# EAGLE schematic Aqua_D_CTRL (EAGLE 9.6.2)

## Sheet 1 of 6
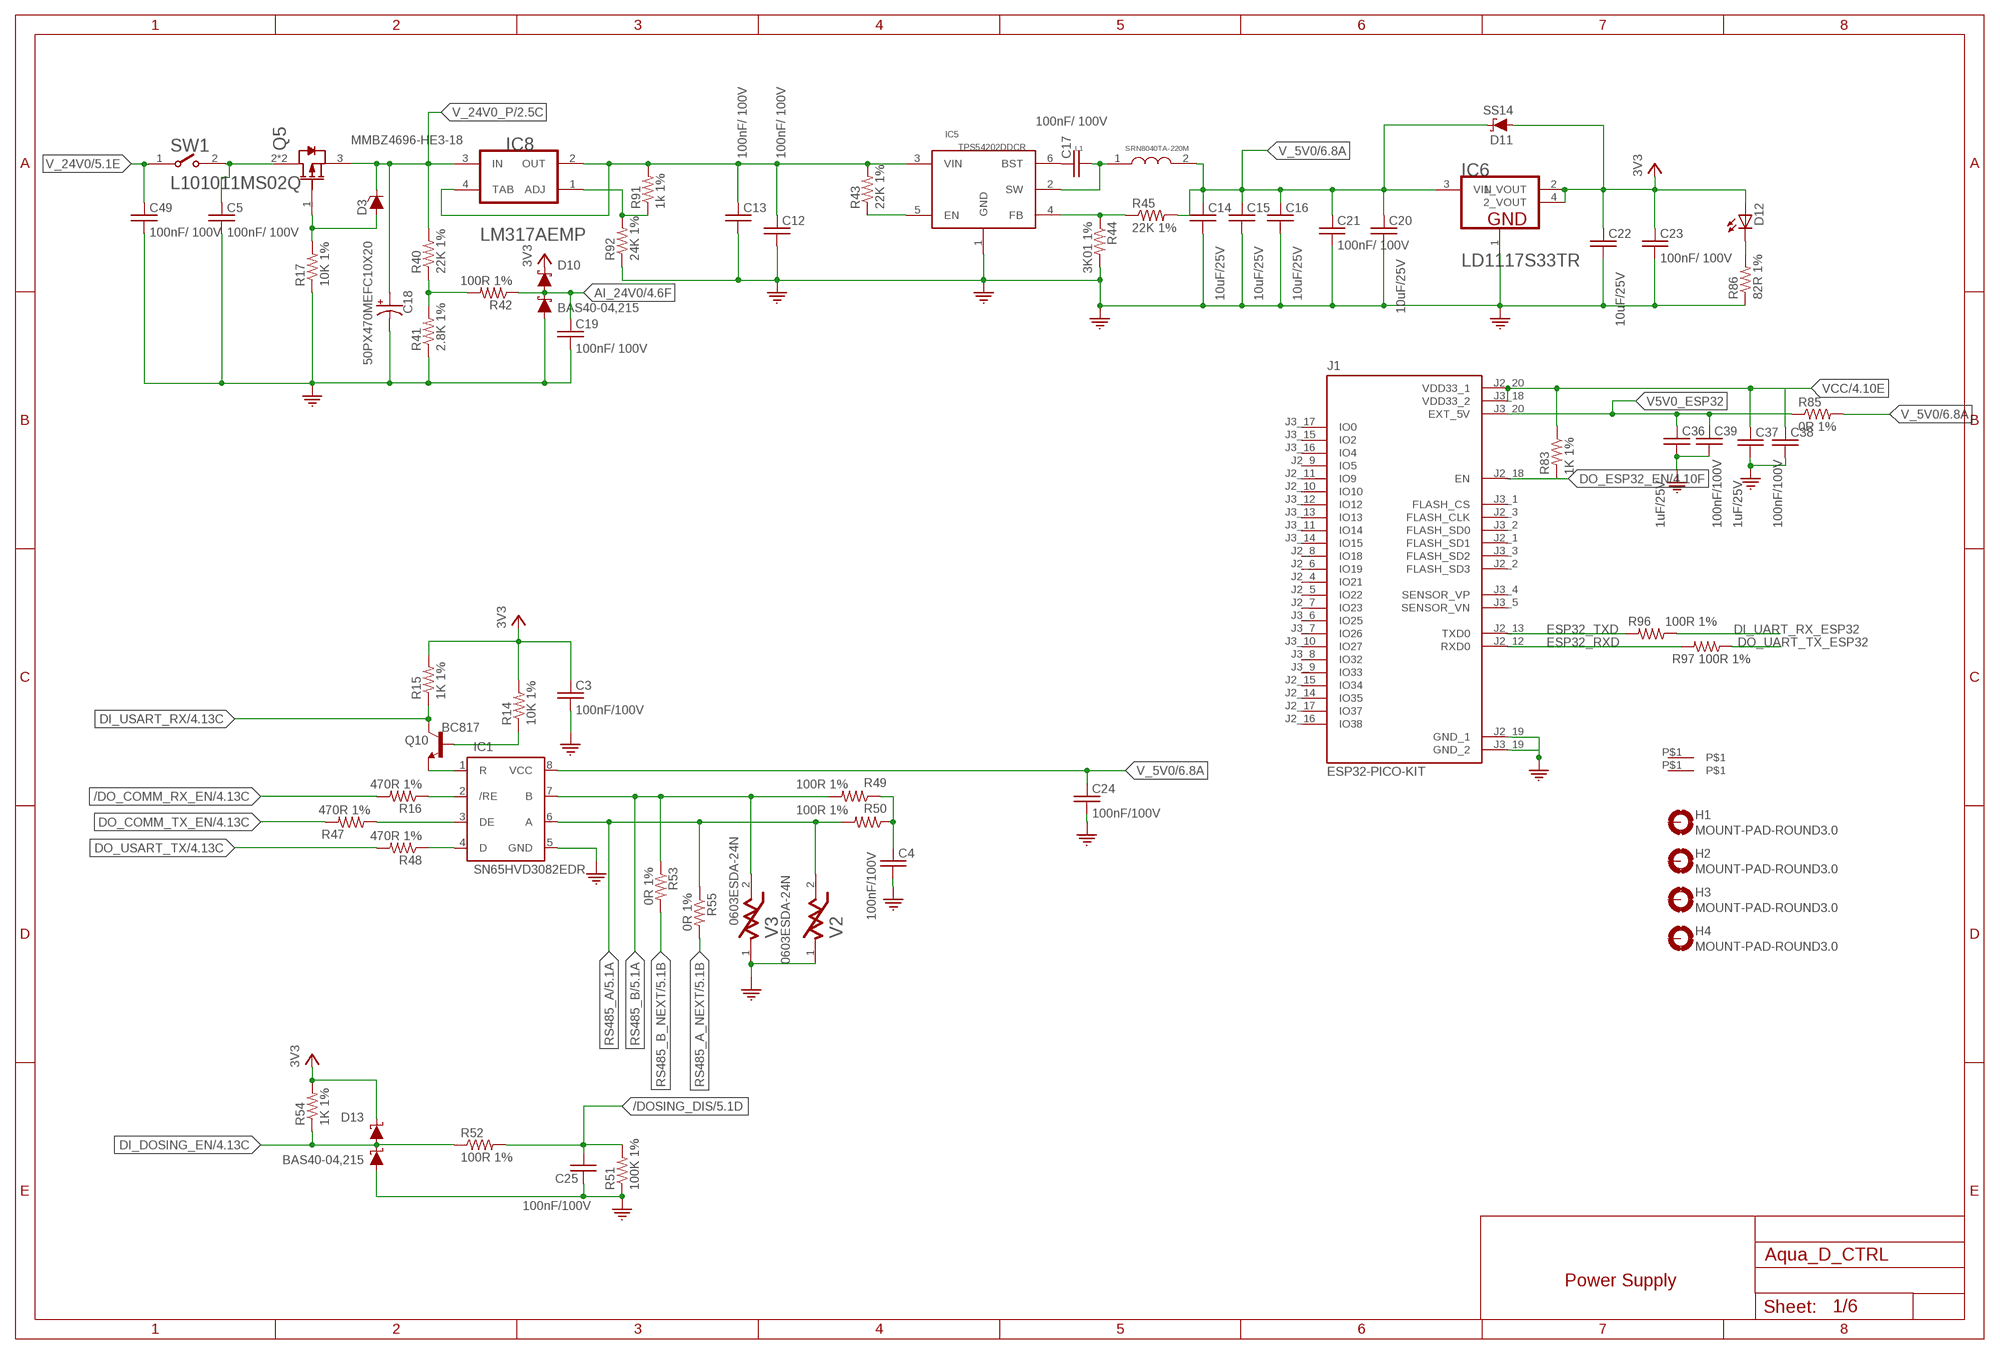
[diagram p0: schematic, sheet 1]

### Parts
C3  100nF/100V  C_0603  [0603]
C4  100nF/100V  C_0603  [0603]
C5  100nF/ 100V  C_0603  [0603]
C12  100nF/ 100V  C_0603  [0603]
C13  100nF/ 100V  C_0603  [0603]
C14  10uF/25V  C_0603  [0603]
C15  10uF/25V  C_0603  [0603]
C16  10uF/25V  C_0603  [0603]
C17  100nF/ 100V  C_0603  [0603]
C18  50PX470MEFC10X20  [CAPACITOR-ELKO-RM5-10X16]
C19  100nF/ 100V  C_0603  [0603]
C20  10uF/25V  C_0603  [0603]
C21  100nF/ 100V  C_0603  [0603]
C22  10uF/25V  C_0603  [0603]
C23  100nF/ 100V  C_0603  [0603]
C24  100nF/100V  C_0603  [0603]
C25  100nF/100V  C_0603  [0603]
C36  1uF/25V  C_0603  [0603]
C37  1uF/25V  C_0603  [0603]
C38  100nF/100V  C_0603  [0603]
C39  100nF/100V  C_0603  [0603]
C49  100nF/ 100V  C_0603  [0603]
D3  MMBZ4696-HE3-18  [SOT23-3]
D10  BAS40-04,215  [SOT23-3]
D11  SS14  [SMA]
D12  26-21/GPC-F3138B/CA  [SMD1206-LED]
D13  BAS40-04,215  [SOT23-3]
FID1  FIDUCIAL  [FIDUCIAL]
FID2  FIDUCIAL  [FIDUCIAL]
H1  MOUNT-PAD-ROUND3.0  [3,0-PAD]
H2  MOUNT-PAD-ROUND3.0  [3,0-PAD]
H3  MOUNT-PAD-ROUND3.0  [3,0-PAD]
H4  MOUNT-PAD-ROUND3.0  [3,0-PAD]
IC1  SN65HVD3082EDR  [SOIC8]
IC5  TPS54202DDCR  [SOT23-6]
IC6  LD1117S33TR  [SOT223_LD1117S33TR]
IC8  LM317AEMP  [SOT223_LM317AEMP]
J1  ESP32-PICO-KIT  [XCVR_ESP32-PICO-KIT]
L1  SRN8040TA-220M  [SRN8040TA-220M]
Q5  DMP6185SEQ-13  [SOT223]
Q10  BC817  [SOT23]
R14  10K 1%  R_0603  [R0603]
R15  1K 1%  R_0603  [R0603]
R16  470R 1%  R_0603  [R0603]
R17  10K 1%  R_0603  [R0603]
R40  22K 1%  R_0603  [R0603]
R41  2.8K 1%  R_0603  [R0603]
R42  100R 1%  R_0603  [R0603]
R43  22K 1%  R_0603  [R0603]
R44  3K01 1%  R_0603  [R0603]
R45  22K 1%  R_0603  [R0603]
R47  470R 1%  R_0603  [R0603]
R48  470R 1%  R_0603  [R0603]
R49  100R 1%  R_0603  [R0603]
R50  100R 1%  R_0603  [R0603]
R51  100K 1%  R_1206  [R1206]
R52  100R 1%  R_0603  [R0603]
R53  0R 1%  R_0603  [R0603]
R54  1K 1%  R_1206  [R1206]
R55  0R 1%  R_0603  [R0603]
R83  1K 1%  R_0603  [R0603]
R85  0R 1%  R_1206  [R1206]
R86  82R 1%  R_1206  [R1206]
R91  1k 1%  R_0603  [R0603]
R92  24K 1%  R_0603  [R0603]
R96  100R 1%  R_0603  [R0603]
R97  100R 1%  R_0603  [R0603]
SW1  L101011MS02Q  [L101011MS02Q]
V2  0603ESDA-24N  [0603]
V3  0603ESDA-24N  [0603]

### Nets
/DO_COMM_RX_EN [LV]: R16.2 ; also sheet 4
/DOSING_DIS [LV]: C25.2 R51.2 R52.2 ; also sheet 5
AI_24V0 [LV]: C19.1 D10.3(C1_A2) R42.1 ; also sheet 4
DI_DOSING_EN [LV]: D13.3(C1_A2) R52.1 R54.1 ; also sheet 4
DI_UART_RX_ESP32 [LV]: R96.1 ; also sheet 4
DI_USART_RX [LV]: Q10.3(C) R15.1 ; also sheet 4
DO_COMM_TX_EN [LV]: R47.2 ; also sheet 4
DO_ESP32_EN [LV]: J1.J2_18(EN) R83.2 ; also sheet 4
DO_UART_TX_ESP32 [LV]: R97.1 ; also sheet 4
DO_USART_TX [LV]: R48.2 ; also sheet 4
ESP32_RXD [LV]: J1.J2_12(RXD0) R97.2
ESP32_TXD [LV]: J1.J2_13(TXD0) R96.2
GND [LV]: C3.2 C4.2 C5.2 C12.2 C13.2 C14.2 C15.2 C16.2 C18.2(-) C19.2 C20.2 C21.2 C22.2 C23.2 C24.2 C25.1 C36.2 C37.2 C38.2 C39.2 C49.2 D10.1(A1) D13.1(A1) IC1.5(GND) IC5.1(GND) IC6.1(GND) J1.J2_19(GND_1) J1.J3_19(GND_2) R17.1 R41.1 R44.2 R51.1 R86.1 R92.1 V2.1 V3.1 ; also sheet 2,3,4,5,6
N$2 [LV]: C5.1 Q5.2(DRAIN) Q5.4(DRAIN) SW1.2
N$9 [LV]: Q10.1(B) R14.1
N$10 [LV]: C12.1 C13.1 IC5.3(VIN) IC8.2(OUT) IC8.4(TAB) R43.2 R91.2
N$16 [LV]: D3.1(A) Q5.1(GATE) R17.2
N$20 [LV]: IC8.1(ADJ) R91.1 R92.2
N$27 [LV]: R40.1 R41.2 R42.2
N$29 [LV]: IC1.1(R) Q10.2(E)
N$30 [LV]: C17.2 IC5.2(SW) L1.1
N$31 [LV]: IC1.2(/RE) R16.1
N$32 [LV]: IC5.5(EN) R43.1
N$33 [LV]: IC5.4(FB) R44.1 R45.1
N$34: C17.1 IC5.6(BST)
N$37 [LV]: IC1.3(DE) R47.1
N$38 [LV]: IC1.4(D) R48.1
N$42 [LV]: C4.1 R49.1 R50.1
N$83 [LV]: D12.2(C) R86.2
RS485_A [LV]: IC1.6(A) R50.2 R55.1 V2.2 ; also sheet 5
RS485_A_NEXT [LV]: R55.2 ; also sheet 5
RS485_B [LV]: IC1.7(B) R49.2 R53.1 V3.2 ; also sheet 5
RS485_B_NEXT [LV]: R53.2 ; also sheet 5
V5V0_ESP32: C36.1 C39.1 J1.J3_20(EXT_5V) R85.1
V_5V0 [LV]: C14.1 C15.1 C16.1 C20.1 C21.1 C24.1 D11.1(C) IC1.8(VCC) IC6.3(VIN) L1.2 R45.2 R85.2 ; also sheet 6
V_24V0 [LV]: C49.1 SW1.1 ; also sheet 5
V_24V0_P [LV]: C18.1(+) D3.3(C) IC8.3(IN) Q5.3(SOURCE) R40.2 ; also sheet 2,3
VCC [LV]: C3.1 C22.1 C23.1 C37.1 C38.1 D10.2(C2) D11.2(A) D12.1(A) D13.2(C2) IC6.2(1_VOUT) IC6.4(2_VOUT) J1.J2_20(VDD33_1) J1.J3_18(VDD33_2) R14.2 R15.2 R54.2 R83.1 ; supply symbol labelled 3V3 ; also sheet 2,3,4
Unconnected: FID1.P$1 FID2.P$1 H1.B3,0(MOUNT) H2.B3,0(MOUNT) H3.B3,0(MOUNT) H4.B3,0(MOUNT) J1.J2_1(FLASH_SD1) J1.J2_2(FLASH_SD3) J1.J2_3(FLASH_CLK) J1.J2_4(IO21) J1.J2_5(IO22) J1.J2_6(IO19) J1.J2_7(IO23) J1.J2_8(IO18) J1.J2_9(IO5) J1.J2_10(IO10) J1.J2_11(IO9) J1.J2_14(IO35) J1.J2_15(IO34) J1.J2_16(IO38) J1.J2_17(IO37) J1.J3_1(FLASH_CS) J1.J3_2(FLASH_SD0) J1.J3_3(FLASH_SD2) J1.J3_4(SENSOR_VP) J1.J3_5(SENSOR_VN) J1.J3_6(IO25) J1.J3_7(IO26) J1.J3_8(IO32) J1.J3_9(IO33) J1.J3_10(IO27) J1.J3_11(IO14) J1.J3_12(IO12) J1.J3_13(IO13) J1.J3_14(IO15) J1.J3_15(IO2) J1.J3_16(IO4) J1.J3_17(IO0)

### Notes on the sheet
- Power Supply

## Sheet 2 of 6
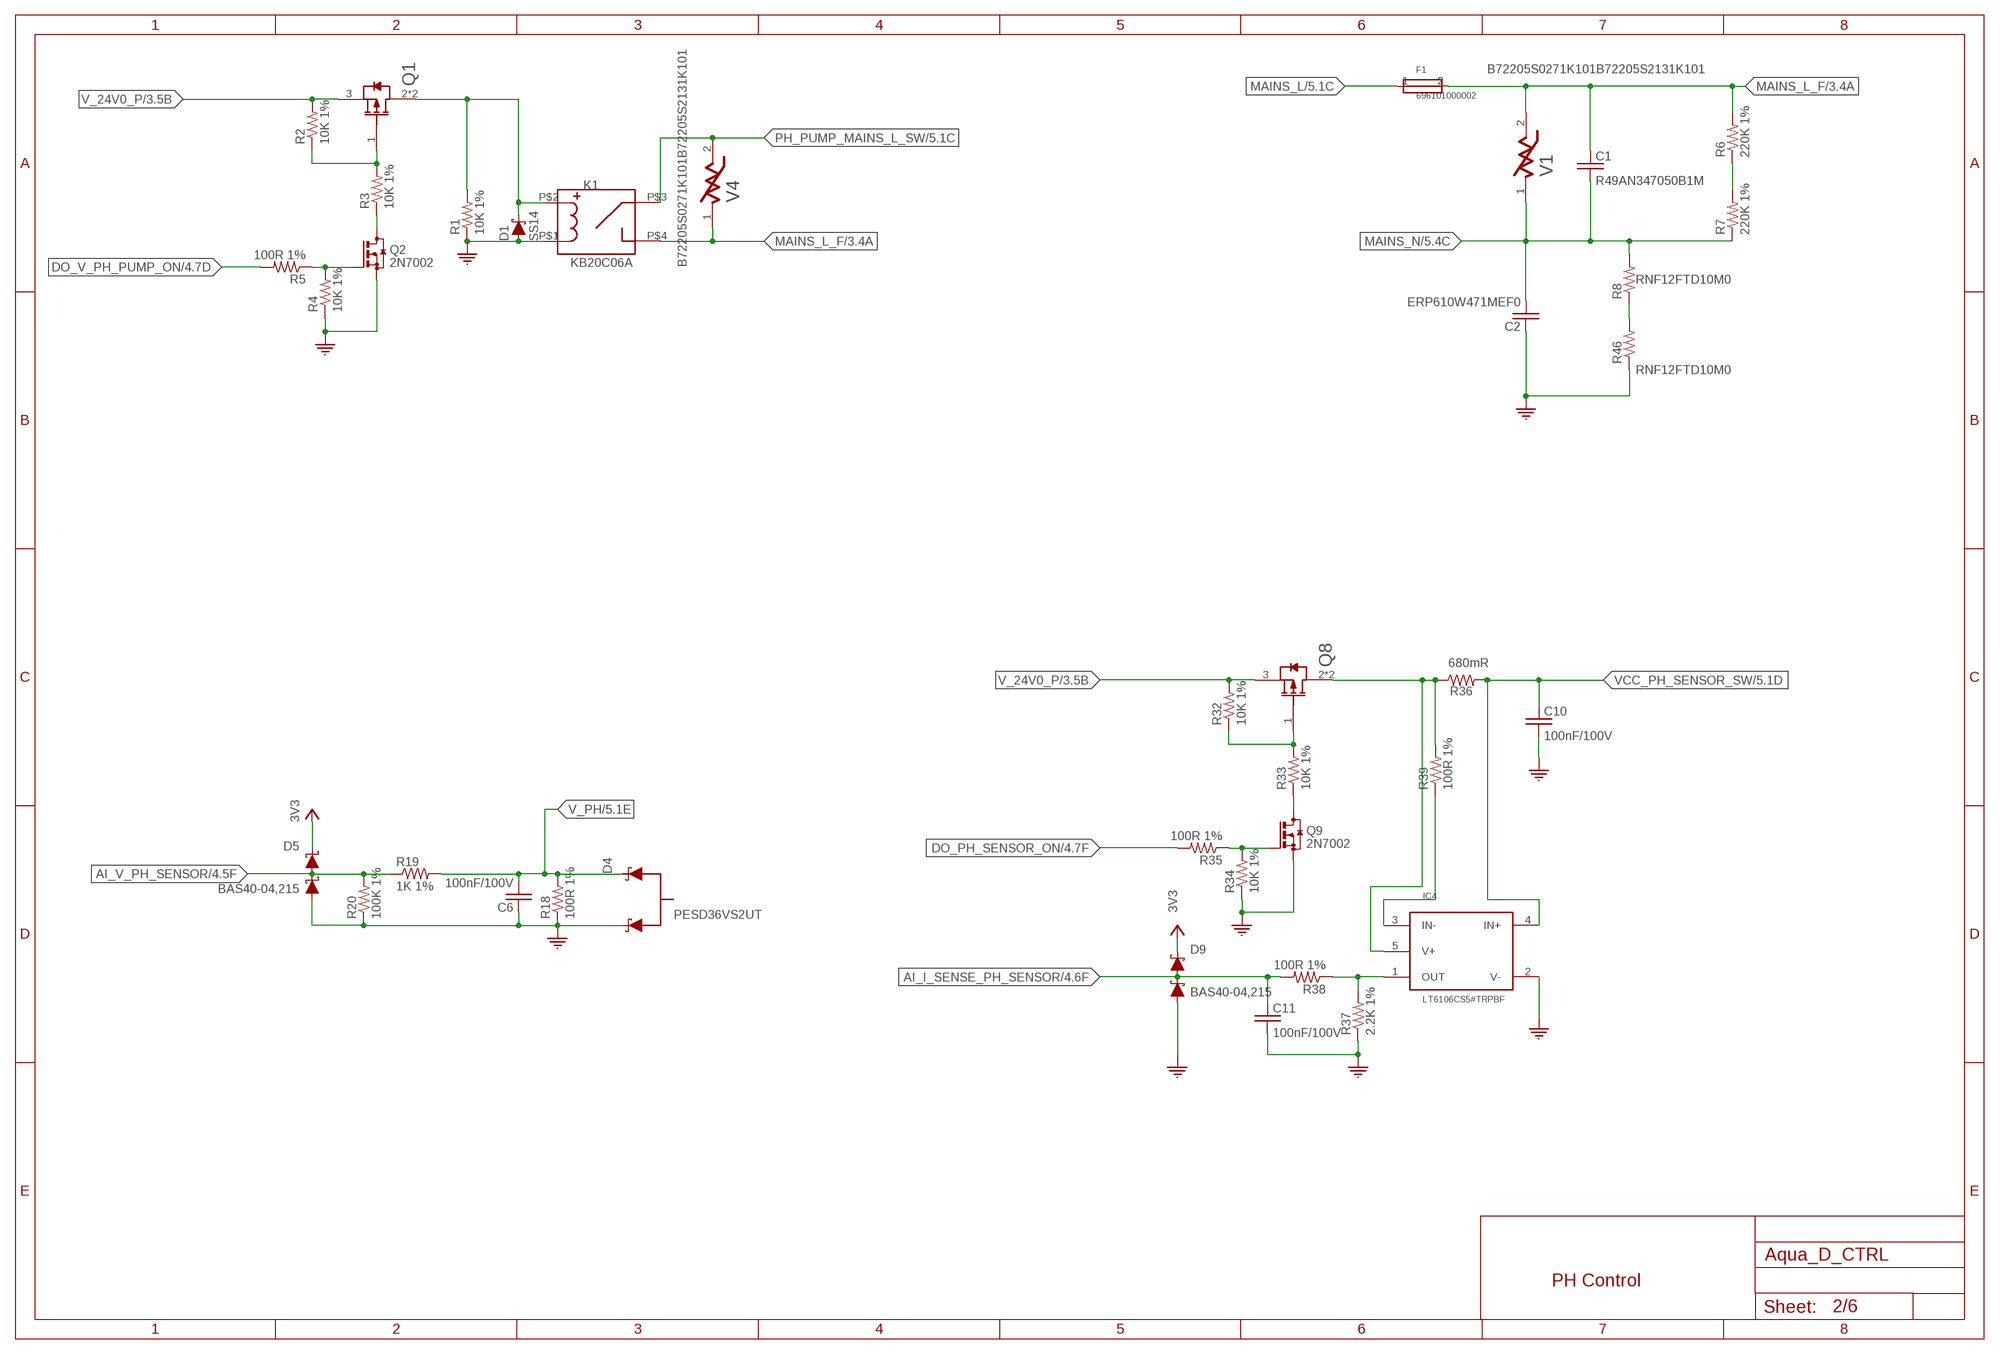
[diagram p1: schematic, sheet 2]

### Parts
C1  R49AN347050B1M  [R49AN347050B1M]
C2  ERP610W471MEF0  [CAP-P12.5-H15-W4-D1]
C6  100nF/100V  C_0603  [0603]
C10  100nF/100V  C_0603  [0603]
C11  100nF/100V  C_0603  [0603]
D1  SS14  [SMA]
D4  PESD36VS2UT  [SOT23-3]
D5  BAS40-04,215  [SOT23-3]
D9  BAS40-04,215  [SOT23-3]
F1  696101000002  [FUSE_RM22.6]
IC4  LT6106CS5#TRPBF  [SOT-23-5]
K1  KB20C06A  [RELAY_KYOTO_KF0604D]
Q1  DMP6185SEQ-13  [SOT223]
Q2  2N7002  [SOT23]
Q8  DMP6185SEQ-13  [SOT223]
Q9  2N7002  [SOT23]
R1  10K 1%  R_0603  [0603]
R2  10K 1%  R_0603  [0603]
R3  10K 1%  R_0603  [0603]
R4  10K 1%  R_0603  [0603]
R5  100R 1%  R_0603  [0603]
R6  220K 1%  R_2010  [R2010]
R7  220K 1%  R_2010  [R2010]
R8  RNF12FTD10M0  [RES-RM12.5-VR37]
R18  100R 1%  R_1206  [R1206]
R19  1K 1%  R_0603  [R0603]
R20  100K 1%  R_0603  [R0603]
R32  10K 1%  R_0603  [0603]
R33  10K 1%  R_0603  [0603]
R34  10K 1%  R_0603  [0603]
R35  100R 1%  R_0603  [0603]
R36  R_2010  [R2010]
R37  2.2K 1%  R_0603  [0603]
R38  100R 1%  R_0603  [0603]
R39  100R 1%  R_0603  [0603]
R46  RNF12FTD10M0  [RES-RM12.5-VR37]
V1  B72205S0271K101B72205S2131K101  [EPCOS_B72205S0271K101_0]
V4  B72205S0271K101B72205S2131K101  [EPCOS_B72205S0271K101_0]

### Nets
AI_I_SENSE_PH_SENSOR [LV]: C11.1 D9.3(C1_A2) R38.2 ; also sheet 4
AI_V_PH_SENSOR [LV]: D5.3(C1_A2) R19.1 R20.2 ; also sheet 4
DO_PH_SENSOR_ON [LV]: R35.2 ; also sheet 4
DO_V_PH_PUMP_ON [LV]: R5.2 ; also sheet 4
GND [LV]: C2.P$1 C6.1 C10.2 C11.2 D1.2(A) D4.1(C1) D5.1(A1) D9.1(A1) IC4.2(V-) K1.P$1 Q2.2(S) Q9.2(S) R1.1 R4.1 R18.1 R20.1 R34.1 R37.1 R46.1 ; also sheet 1,3,4,5,6
MAINS_L [Mains_L]: F1.1 ; also sheet 5
MAINS_L_F [Mains_L]: C1.1 F1.2 K1.P$4 R6.2 V1.2 V4.1 ; also sheet 3
MAINS_N [Mains_N]: C1.2 C2.P$2 R7.1 R8.2 V1.1 ; also sheet 5
N$1 [LV]: D1.1(C) K1.P$2 Q1.2(DRAIN) Q1.4(DRAIN) R1.2
N$3 [LV]: Q1.1(GATE) R2.1 R3.2
N$4 [Mains_N]: R6.1 R7.2
N$6 [LV]: Q2.3(D) R3.1
N$8 [LV]: Q2.1(G) R4.2 R5.1
N$21 [LV]: Q8.1(GATE) R32.1 R33.2
N$22 [LV]: Q9.3(D) R33.1
N$23 [LV]: Q9.1(G) R34.2 R35.1
N$24 [LV]: IC4.3(IN-) R39.1
N$25 [LV]: IC4.1(OUT) R37.2 R38.1
N$26 [LV]: IC4.5(V+) Q8.2(DRAIN) Q8.4(DRAIN) R36.1 R39.2
N$28: R8.1 R46.2
PH_PUMP_MAINS_L_SW [Mains_L]: K1.P$3 V4.2 ; also sheet 5
V_24V0_P [LV]: Q1.3(SOURCE) Q8.3(SOURCE) R2.2 R32.2 ; also sheet 1,3
V_PH [LV]: C6.2 D4.2(C2) R18.2 R19.2 ; also sheet 5
VCC [LV]: D5.2(C2) D9.2(C2) ; supply symbol labelled 3V3 ; also sheet 1,3,4
VCC_PH_SENSOR_SW [LV]: C10.1 IC4.4(IN+) R36.2 ; also sheet 5
Unconnected: D4.3(A)

### Notes on the sheet
- PH Control

## Sheet 3 of 6
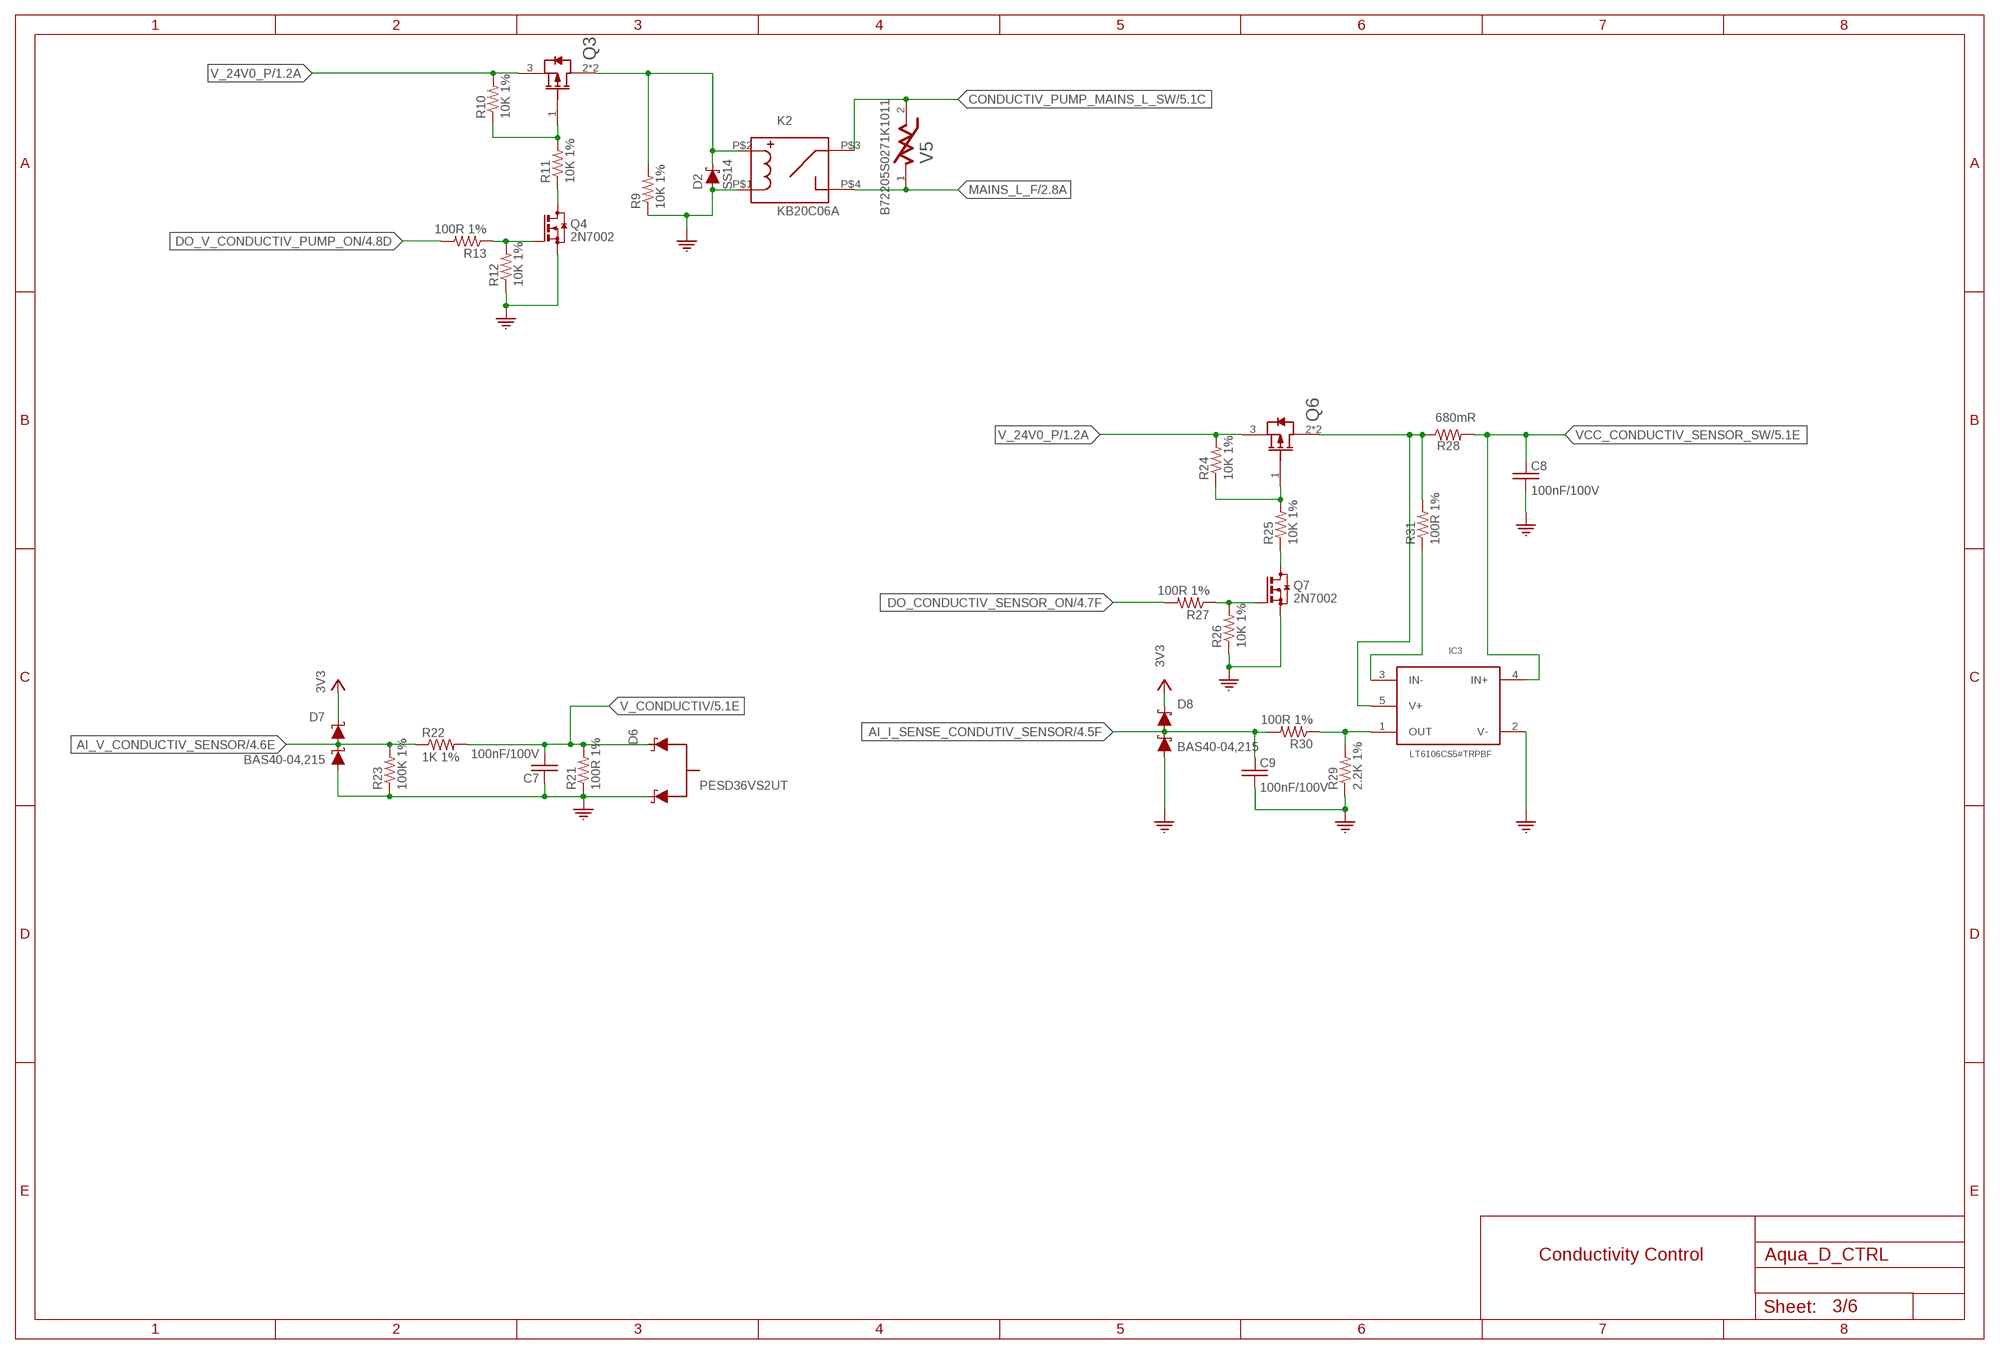
[diagram p2: schematic, sheet 3]

### Parts
C7  100nF/100V  C_0603  [0603]
C8  100nF/100V  C_0603  [0603]
C9  100nF/100V  C_0603  [0603]
D2  SS14  [SMA]
D6  PESD36VS2UT  [SOT23-3]
D7  BAS40-04,215  [SOT23-3]
D8  BAS40-04,215  [SOT23-3]
IC3  LT6106CS5#TRPBF  [SOT-23-5]
K2  KB20C06A  [RELAY_KYOTO_KF0604D]
Q3  DMP6185SEQ-13  [SOT223]
Q4  2N7002  [SOT23]
Q6  DMP6185SEQ-13  [SOT223]
Q7  2N7002  [SOT23]
R9  10K 1%  R_0603  [0603]
R10  10K 1%  R_0603  [0603]
R11  10K 1%  R_0603  [0603]
R12  10K 1%  R_0603  [0603]
R13  100R 1%  R_0603  [0603]
R21  100R 1%  R_1206  [R1206]
R22  1K 1%  R_0603  [R0603]
R23  100K 1%  R_0603  [R0603]
R24  10K 1%  R_0603  [0603]
R25  10K 1%  R_0603  [0603]
R26  10K 1%  R_0603  [0603]
R27  100R 1%  R_0603  [0603]
R28  R_2010  [R2010]
R29  2.2K 1%  R_0603  [0603]
R30  100R 1%  R_0603  [0603]
R31  100R 1%  R_0603  [0603]
V5  B72205S0271K1011  [EPCOS_B72205S0271K101_MODIFIED]

### Nets
AI_I_SENSE_CONDUTIV_SENSOR [LV]: C9.1 D8.3(C1_A2) R30.2 ; also sheet 4
AI_V_CONDUCTIV_SENSOR [LV]: D7.3(C1_A2) R22.1 R23.2 ; also sheet 4
CONDUCTIV_PUMP_MAINS_L_SW [Mains_L]: K2.P$3 V5.2 ; also sheet 5
DO_CONDUCTIV_SENSOR_ON [LV]: R27.2 ; also sheet 4
DO_V_CONDUCTIV_PUMP_ON [LV]: R13.2 ; also sheet 4
GND [LV]: C7.1 C8.2 C9.2 D2.2(A) D6.1(C1) D7.1(A1) D8.1(A1) IC3.2(V-) K2.P$1 Q4.2(S) Q7.2(S) R9.1 R12.1 R21.1 R23.1 R26.1 R29.1 ; also sheet 1,2,4,5,6
MAINS_L_F [Mains_L]: K2.P$4 V5.1 ; also sheet 2
N$5: D2.1(C) K2.P$2 Q3.2(DRAIN) Q3.4(DRAIN) R9.2
N$7 [LV]: IC3.3(IN-) R31.1
N$11 [LV]: Q3.1(GATE) R10.1 R11.2
N$12 [LV]: Q4.3(D) R11.1
N$13 [LV]: Q6.1(GATE) R24.1 R25.2
N$14 [LV]: Q4.1(G) R12.2 R13.1
N$15 [LV]: Q7.3(D) R25.1
N$17 [LV]: Q7.1(G) R26.2 R27.1
N$18 [LV]: IC3.1(OUT) R29.2 R30.1
N$19 [LV]: IC3.5(V+) Q6.2(DRAIN) Q6.4(DRAIN) R28.1 R31.2
V_24V0_P [LV]: Q3.3(SOURCE) Q6.3(SOURCE) R10.2 R24.2 ; also sheet 1,2
V_CONDUCTIV [LV]: C7.2 D6.2(C2) R21.2 R22.2 ; also sheet 5
VCC [LV]: D7.2(C2) D8.2(C2) ; supply symbol labelled 3V3 ; also sheet 1,2,4
VCC_CONDUCTIV_SENSOR_SW [LV]: C8.1 IC3.4(IN+) R28.2 ; also sheet 5
Unconnected: D6.3(A)

### Notes on the sheet
- Conductivity Control

## Sheet 4 of 6
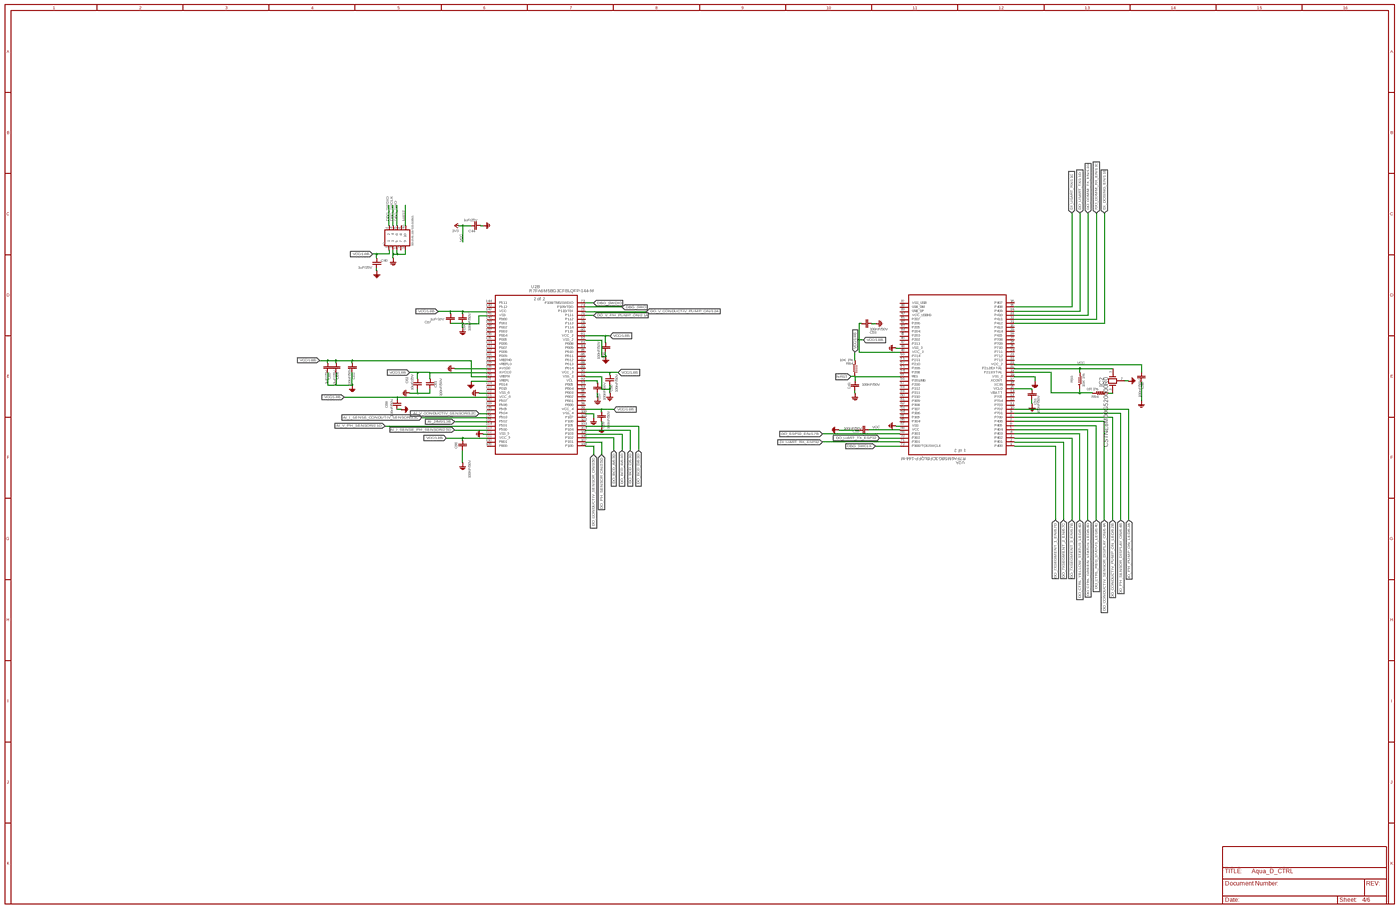
[diagram p3: schematic, sheet 4, overview]
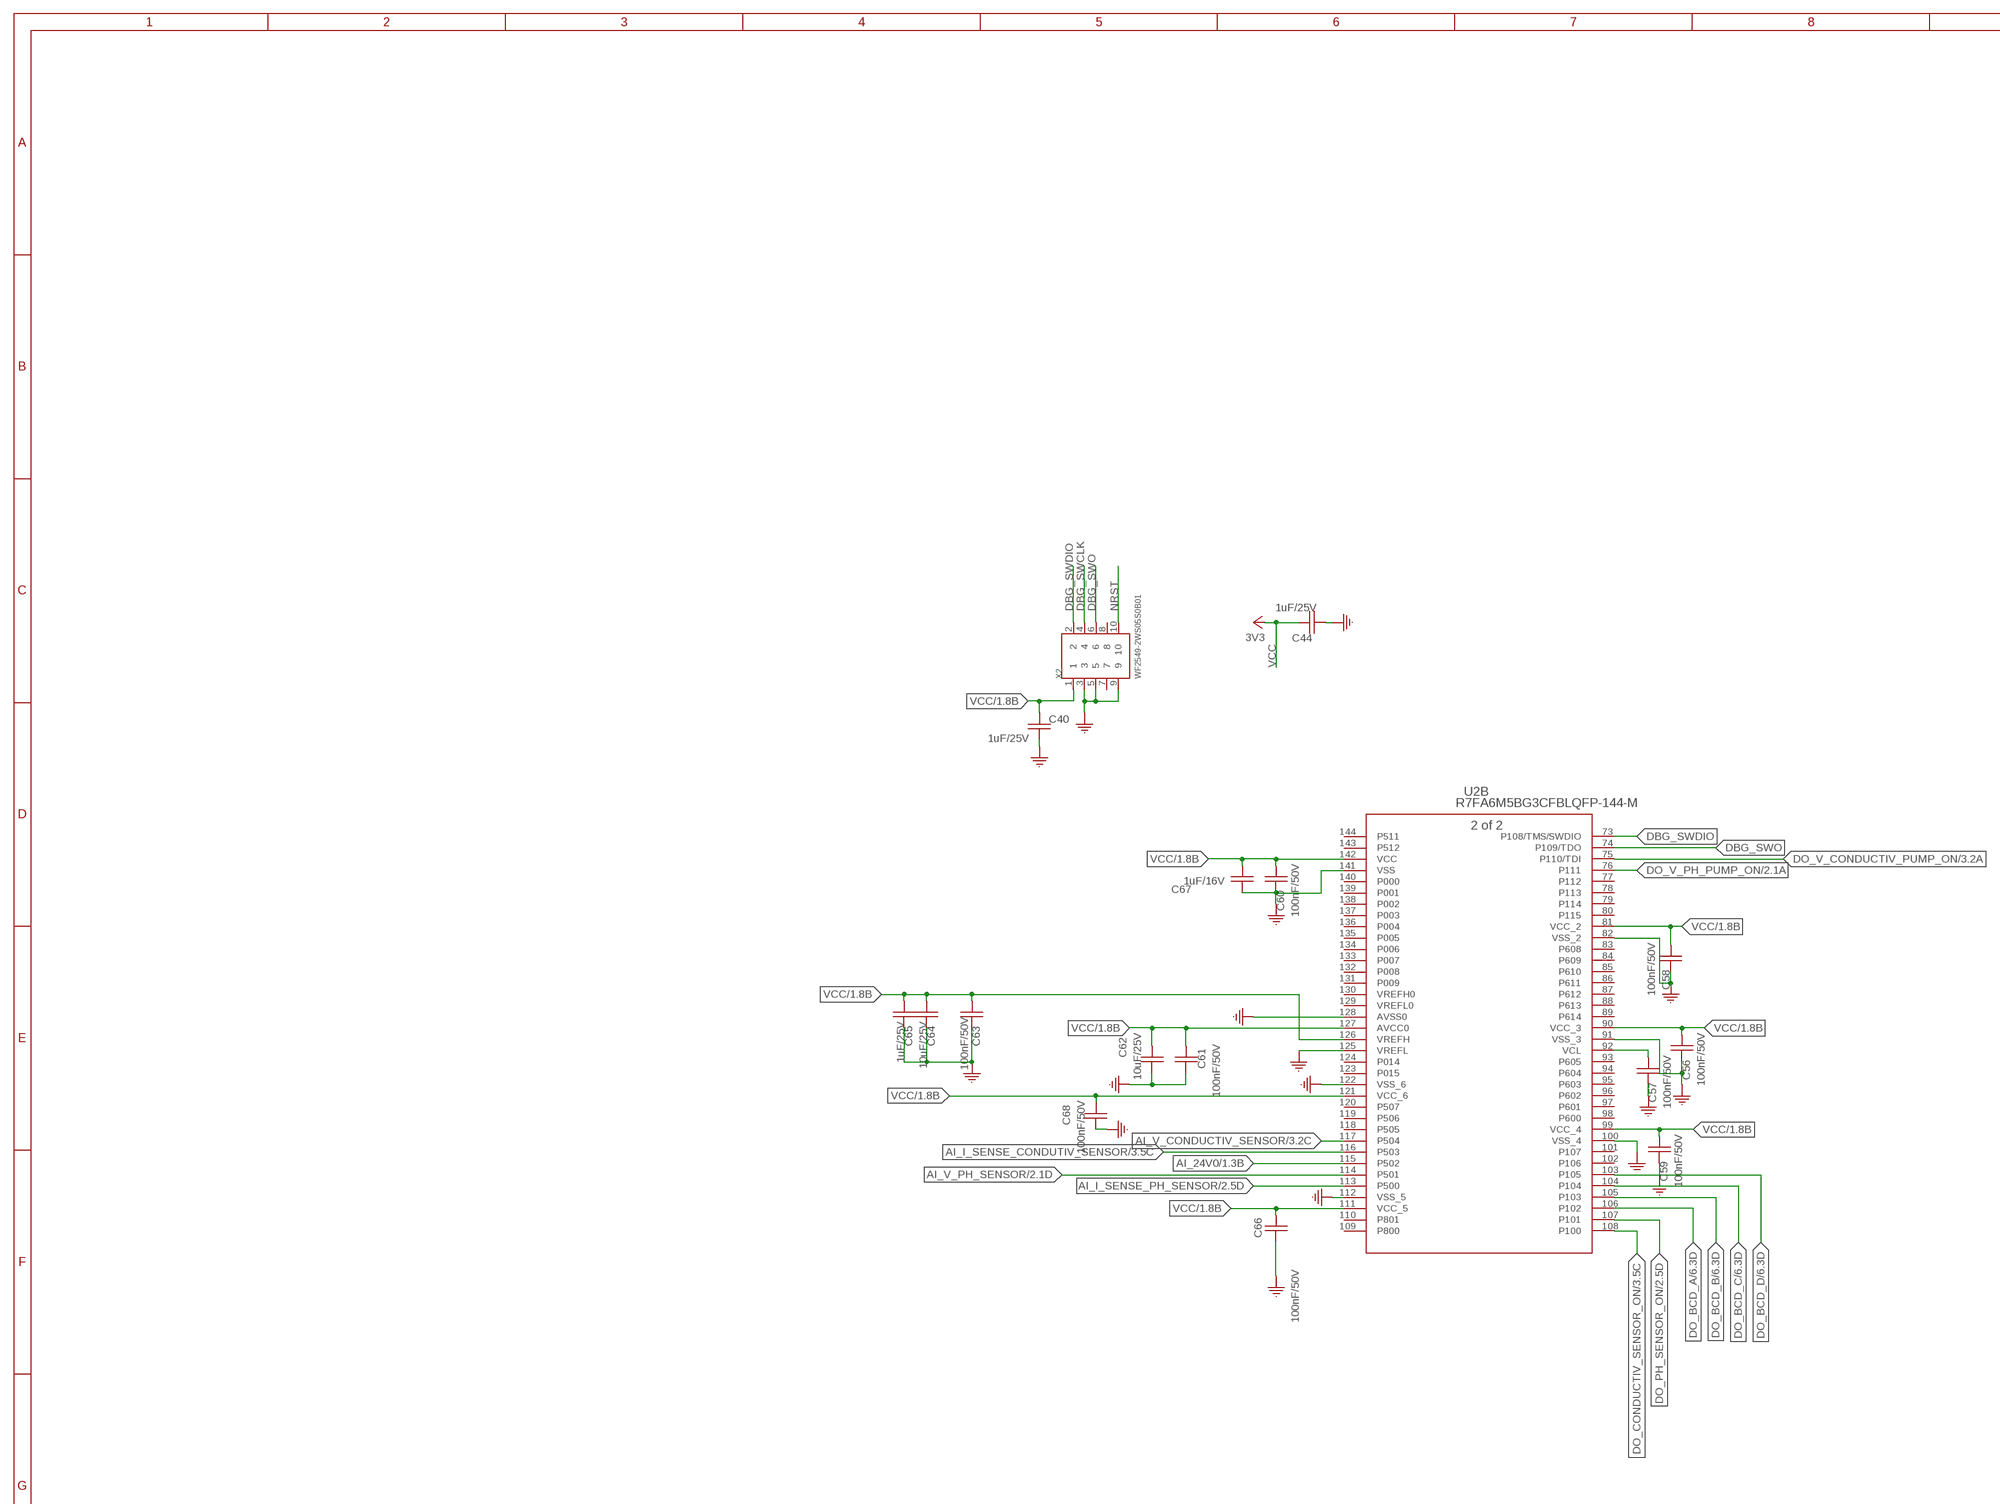
[diagram p4: schematic, sheet 4, part 1 of 4]
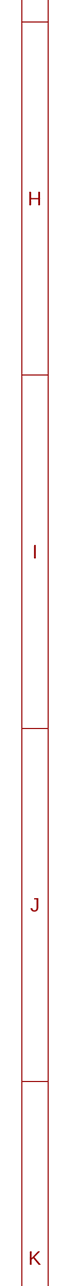
[diagram p5: schematic, sheet 4, part 2 of 4]
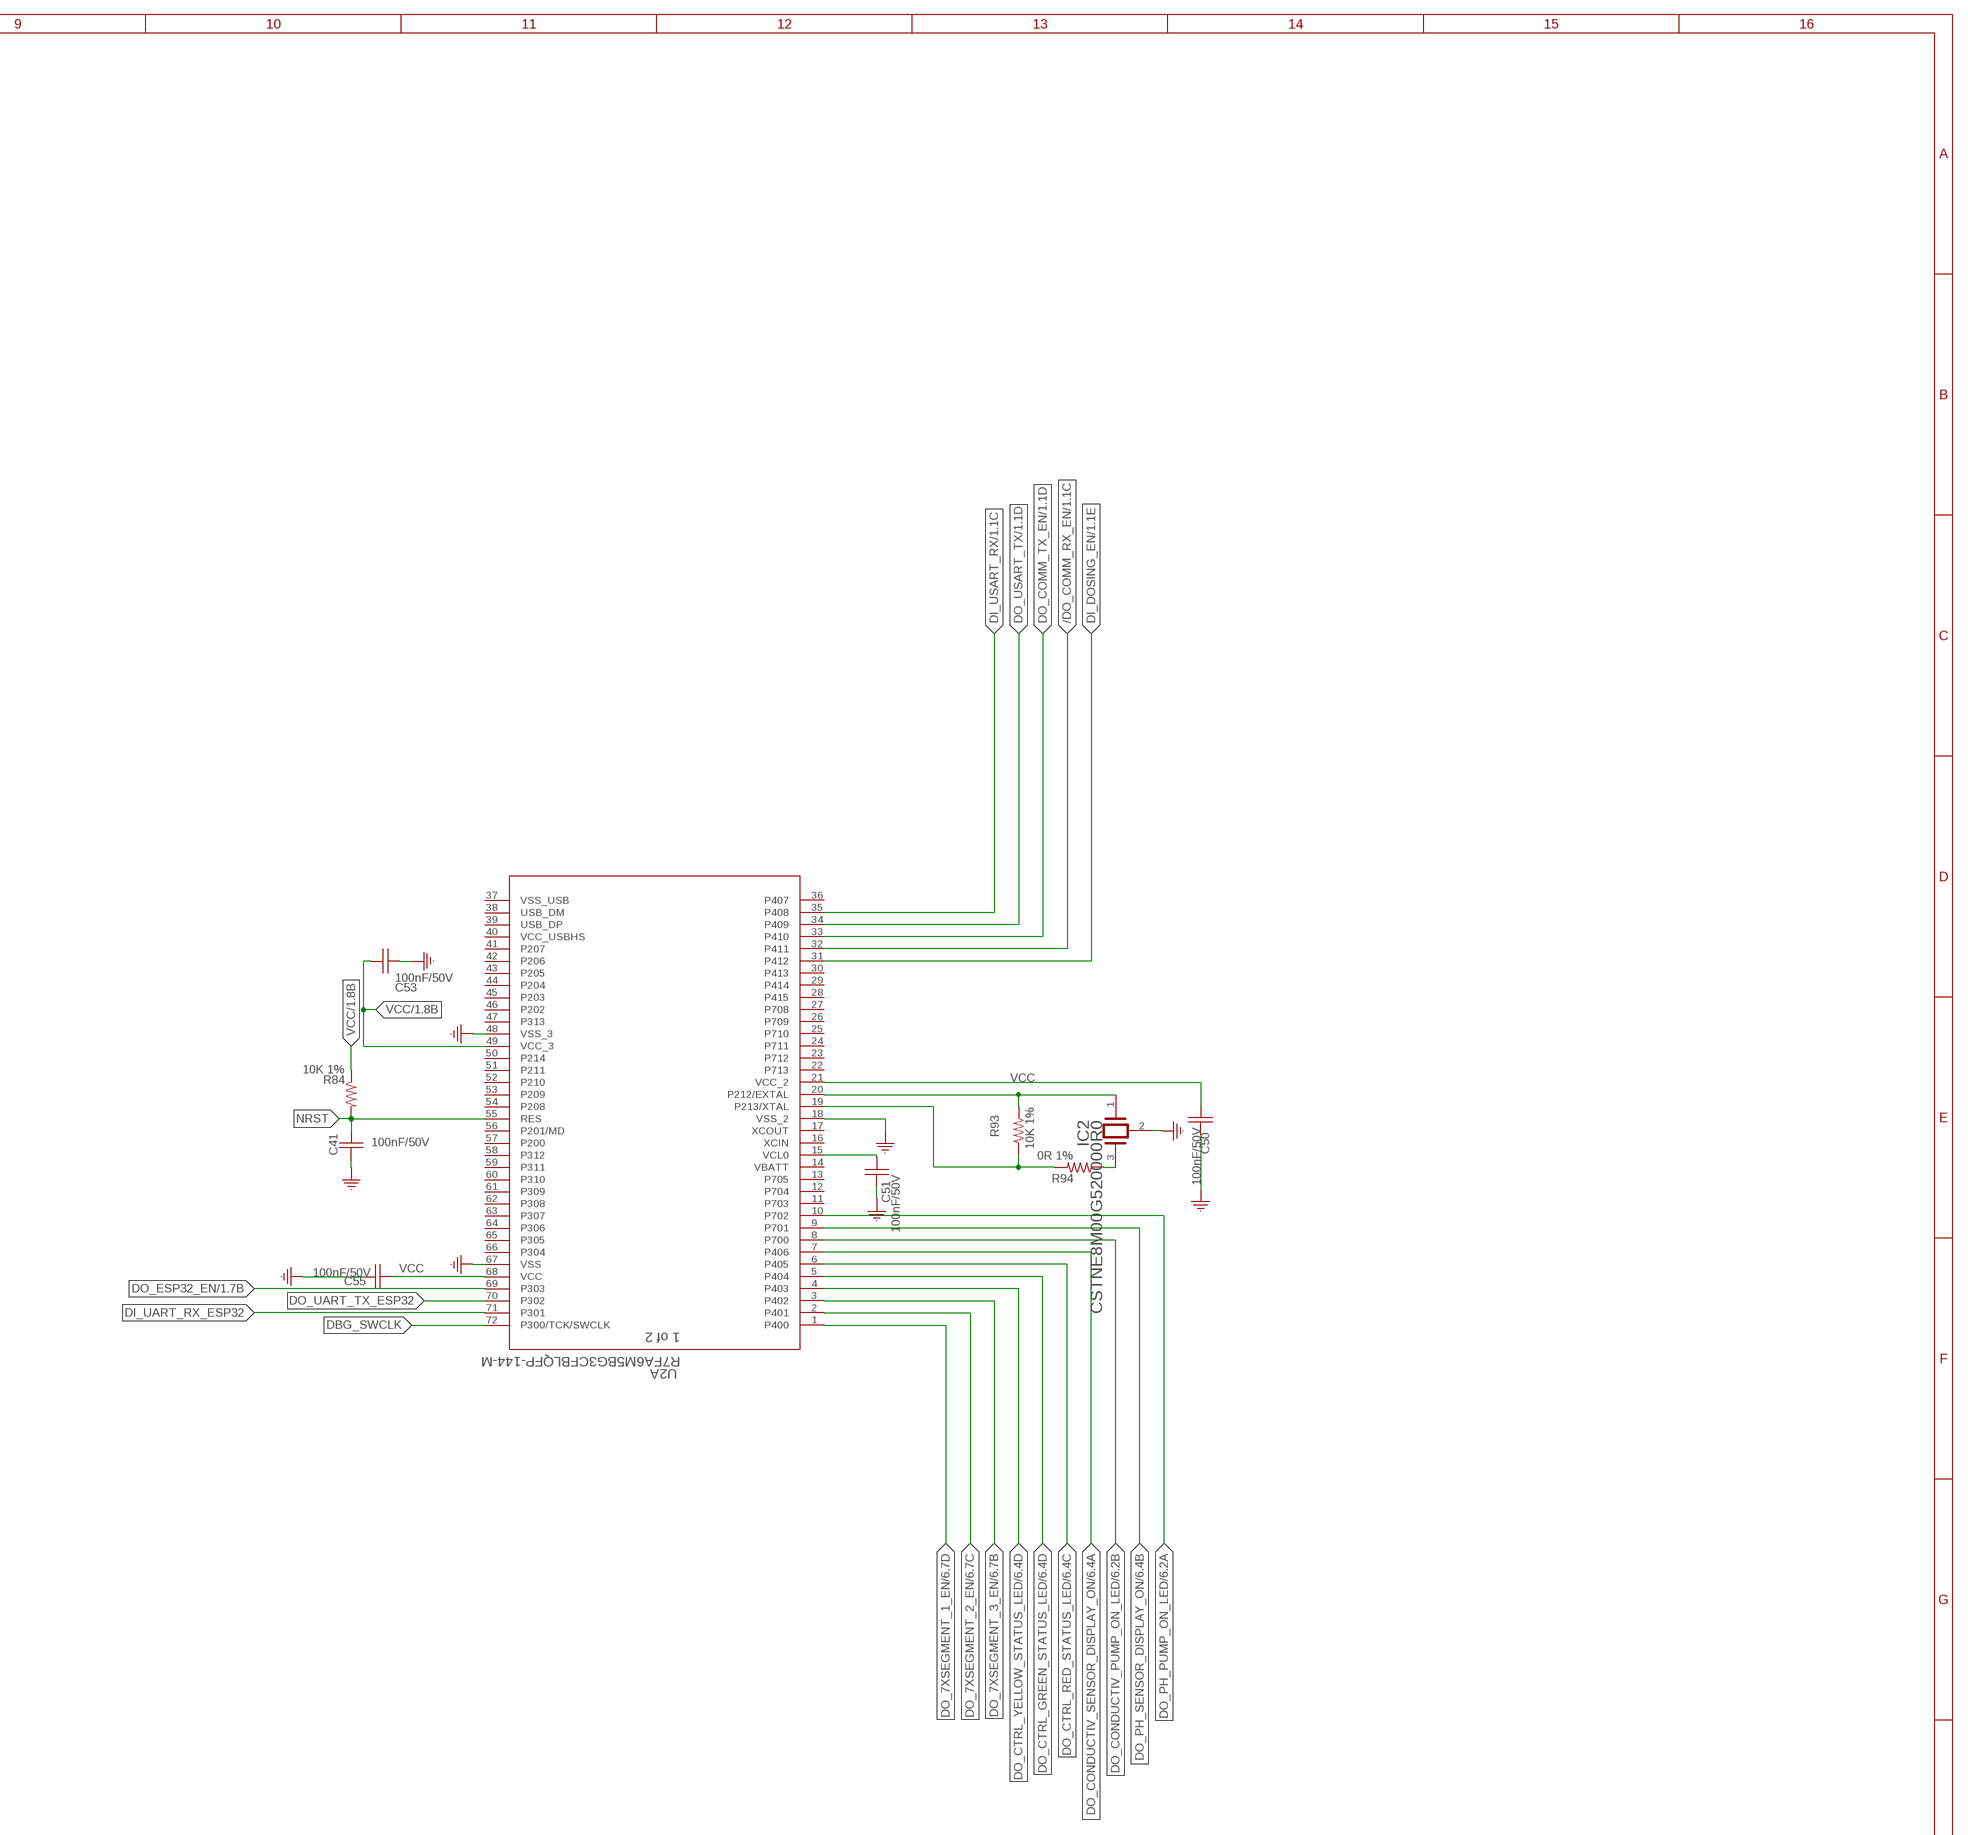
[diagram p6: schematic, sheet 4, part 3 of 4]
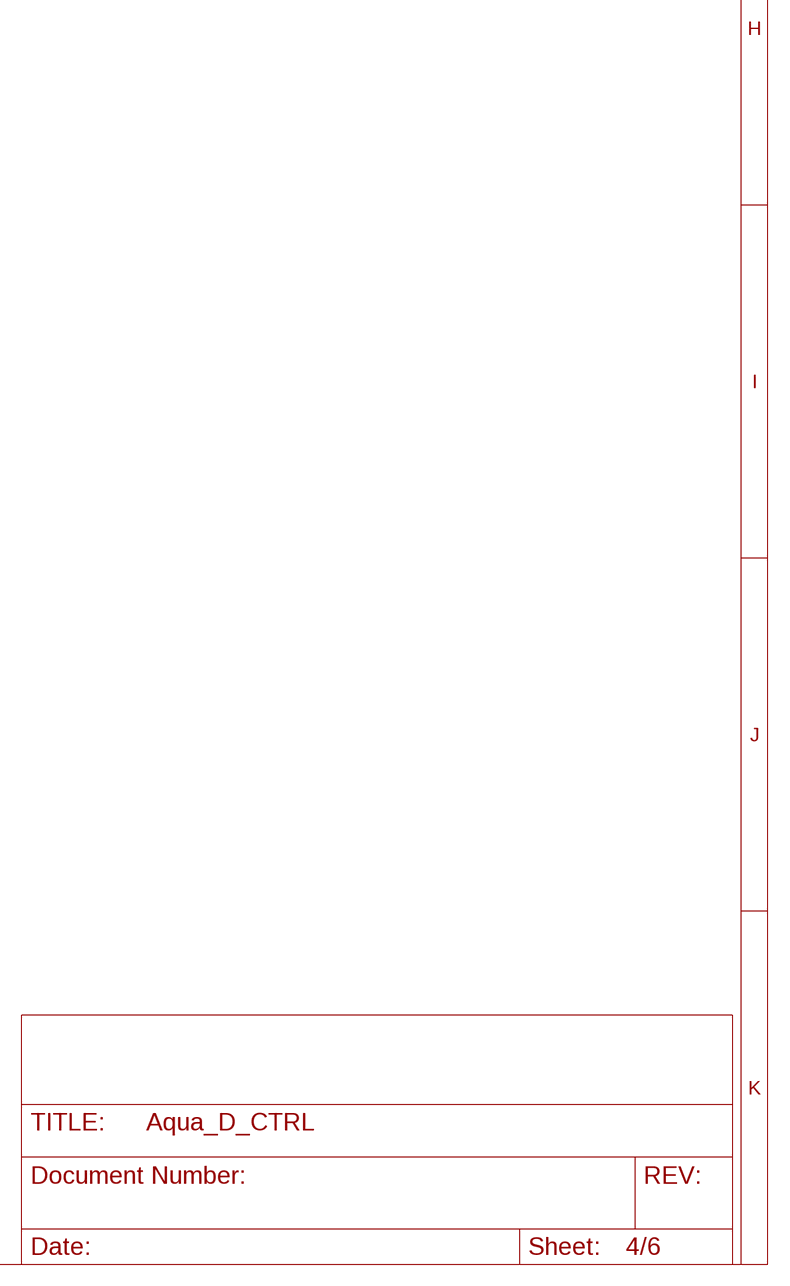
[diagram p7: schematic, sheet 4, part 4 of 4]

### Parts
C40  1uF/25V  C_0603  [0603]
C41  100nF/50V  C_0603  [0603]
C44  1uF/25V  C_0603  [0603]
C50  100nF/50V  C_0603  [0603]
C51  100nF/50V  C_0603  [0603]
C53  100nF/50V  C_0603  [0603]
C55  100nF/50V  C_0603  [0603]
C56  100nF/50V  C_0603  [0603]
C57  100nF/50V  C_0603  [0603]
C58  100nF/50V  C_0603  [0603]
C59  100nF/50V  C_0603  [0603]
C60  100nF/50V  C_0603  [0603]
C61  100nF/50V  C_0603  [0603]
C62  10uF/25V  C_0603  [0603]
C63  100nF/50V  C_0603  [0603]
C64  10uF/25V  C_0603  [0603]
C65  1uF/25V  C_0603  [0603]
C66  100nF/50V  C_0603  [0603]
C67  1uF/16V  C_0603  [0603]
C68  100nF/50V  C_0603  [0603]
IC2  CSTNE8M00G520000R0  [CSTNE8M00G520000R0]
R84  10K 1%  R_0603  [R0603]
R93  10K 1%  R_0603  [R0603]
R94  0R 1%  R_0603  [R0603]
U2  R7FA6M5BG3CFBLQFP-144-M  [LQFP-144-M]
X2  WF2549-2WS05S0B01  [X10_100MIL_2XROW_VERT]

### Nets
/DO_COMM_RX_EN [LV]: U2.32(A:P411) ; also sheet 1
AI_24V0 [LV]: U2.115(B:P502) ; also sheet 1
AI_I_SENSE_CONDUTIV_SENSOR [LV]: U2.116(B:P503) ; also sheet 3
AI_I_SENSE_PH_SENSOR [LV]: U2.113(B:P500) ; also sheet 2
AI_V_CONDUCTIV_SENSOR [LV]: U2.117(B:P504) ; also sheet 3
AI_V_PH_SENSOR [LV]: U2.114(B:P501) ; also sheet 2
DBG_SWCLK [LV]: U2.72(A:P300/TCK/SWCLK) X2.4
DBG_SWDIO [LV]: U2.73(B:P108/TMS/SWDIO) X2.2
DBG_SWO [LV]: U2.74(B:P109/TDO) X2.6
DI_DOSING_EN [LV]: U2.31(A:P412) ; also sheet 1
DI_UART_RX_ESP32 [LV]: U2.71(A:P301) ; also sheet 1
DI_USART_RX [LV]: U2.35(A:P408) ; also sheet 1
DO_7XSEGMENT_1_EN [LV]: U2.1(A:P400) ; also sheet 6
DO_7XSEGMENT_2_EN [LV]: U2.2(A:P401) ; also sheet 6
DO_7XSEGMENT_3_EN [LV]: U2.3(A:P402) ; also sheet 6
DO_BCD_A [LV]: U2.106(B:P102) ; also sheet 6
DO_BCD_B [LV]: U2.105(B:P103) ; also sheet 6
DO_BCD_C [LV]: U2.104(B:P104) ; also sheet 6
DO_BCD_D [LV]: U2.103(B:P105) ; also sheet 6
DO_COMM_TX_EN [LV]: U2.33(A:P410) ; also sheet 1
DO_CONDUCTIV_PUMP_ON_LED [LV]: U2.8(A:P700) ; also sheet 6
DO_CONDUCTIV_SENSOR_DISPLAY_ON [LV]: U2.7(A:P406) ; also sheet 6
DO_CONDUCTIV_SENSOR_ON [LV]: U2.108(B:P100) ; also sheet 3
DO_CTRL_GREEN_STATUS_LED [LV]: U2.5(A:P404) ; also sheet 6
DO_CTRL_RED_STATUS_LED [LV]: U2.6(A:P405) ; also sheet 6
DO_CTRL_YELLOW_STATUS_LED [LV]: U2.4(A:P403) ; also sheet 6
DO_ESP32_EN [LV]: U2.69(A:P303) ; also sheet 1
DO_PH_PUMP_ON_LED [LV]: U2.10(A:P702) ; also sheet 6
DO_PH_SENSOR_DISPLAY_ON [LV]: U2.9(A:P701) ; also sheet 6
DO_PH_SENSOR_ON [LV]: U2.107(B:P101) ; also sheet 2
DO_UART_TX_ESP32 [LV]: U2.70(A:P302) ; also sheet 1
DO_USART_TX [LV]: U2.34(A:P409) ; also sheet 1
DO_V_CONDUCTIV_PUMP_ON [LV]: U2.75(B:P110/TDI) ; also sheet 3
DO_V_PH_PUMP_ON [LV]: U2.76(B:P111) ; also sheet 2
GND [LV]: C40.2 C41.2 C44.2 C50.1 C51.1 C53.1 C55.1 C56.1 C57.1 C58.1 C59.1 C60.1 C61.1 C62.1 C63.1 C64.1 C65.1 C66.1 C67.1 C68.1 IC2.2(GND) U2.18(A:VSS_2) U2.48(A:VSS_3) U2.67(A:VSS) U2.82(B:VSS_2) U2.91(B:VSS_3) U2.100(B:VSS_4) U2.112(B:VSS_5) U2.122(B:VSS_6) U2.125(B:VREFL) U2.128(B:AVSS0) U2.141(B:VSS) X2.3 X2.5 X2.9 ; also sheet 1,2,3,5,6
N$49 [LV]: IC2.3(OUTPUT) R94.1
N$55 [LV]: R93.1 R94.2 U2.19(A:P213/XTAL)
N$63 [LV]: C51.2 U2.15(A:VCL0)
N$66 [LV]: IC2.1(INPUT) R93.2 U2.20(A:P212/EXTAL)
N$88 [LV]: C57.2 U2.92(B:VCL)
NRST [LV]: C41.1 R84.2 U2.55(A:RES) X2.10
VCC [LV]: C40.1 C44.1 C50.2 C53.2 C55.2 C56.2 C58.2 C59.2 C60.2 C61.2 C62.2 C63.2 C64.2 C65.2 C66.2 C67.2 C68.2 R84.1 U2.21(A:VCC_2) U2.49(A:VCC_3) U2.68(A:VCC) U2.81(B:VCC_2) U2.90(B:VCC_3) U2.99(B:VCC_4) U2.111(B:VCC_5) U2.121(B:VCC_6) U2.126(B:VREFH) U2.127(B:AVCC0) U2.142(B:VCC) X2.1 ; supply symbol labelled 3V3 ; also sheet 1,2,3
Unconnected: U2.11(A:P703) U2.12(A:P704) U2.13(A:P705) U2.16(A:XCIN) U2.17(A:XCOUT) U2.22(A:P713) U2.23(A:P712) U2.24(A:P711) U2.25(A:P710) U2.26(A:P709) U2.27(A:P708) U2.28(A:P415) U2.29(A:P414) U2.30(A:P413) U2.36(A:P407) U2.38(A:USB_DM) U2.39(A:USB_DP) U2.41(A:P207) U2.42(A:P206) U2.43(A:P205) U2.44(A:P204) U2.45(A:P203) U2.46(A:P202) U2.47(A:P313) U2.50(A:P214) U2.51(A:P211) U2.52(A:P210) U2.53(A:P209) U2.54(A:P208) U2.56(A:P201/MD) U2.57(A:P200) U2.58(A:P312) U2.59(A:P311) U2.60(A:P310) U2.61(A:P309) U2.62(A:P308) U2.63(A:P307) U2.64(A:P306) U2.65(A:P305) U2.66(A:P304) U2.77(B:P112) U2.78(B:P113) U2.79(B:P114) U2.80(B:P115) U2.83(B:P608) U2.84(B:P609) U2.85(B:P610) U2.86(B:P611) U2.87(B:P612) U2.88(B:P613) U2.89(B:P614) U2.93(B:P605) U2.94(B:P604) U2.95(B:P603) U2.96(B:P602) U2.97(B:P601) U2.98(B:P600) U2.101(B:P107) U2.102(B:P106) U2.109(B:P800) U2.110(B:P801) U2.118(B:P505) U2.119(B:P506) U2.120(B:P507) U2.123(B:P015) U2.124(B:P014) U2.131(B:P009) U2.132(B:P008) U2.133(B:P007) U2.134(B:P006) U2.135(B:P005) U2.136(B:P004) U2.137(B:P003) U2.138(B:P002) U2.139(B:P001) U2.140(B:P000) U2.143(B:P512) U2.144(B:P511) X2.7 X2.8

## Sheet 5 of 6
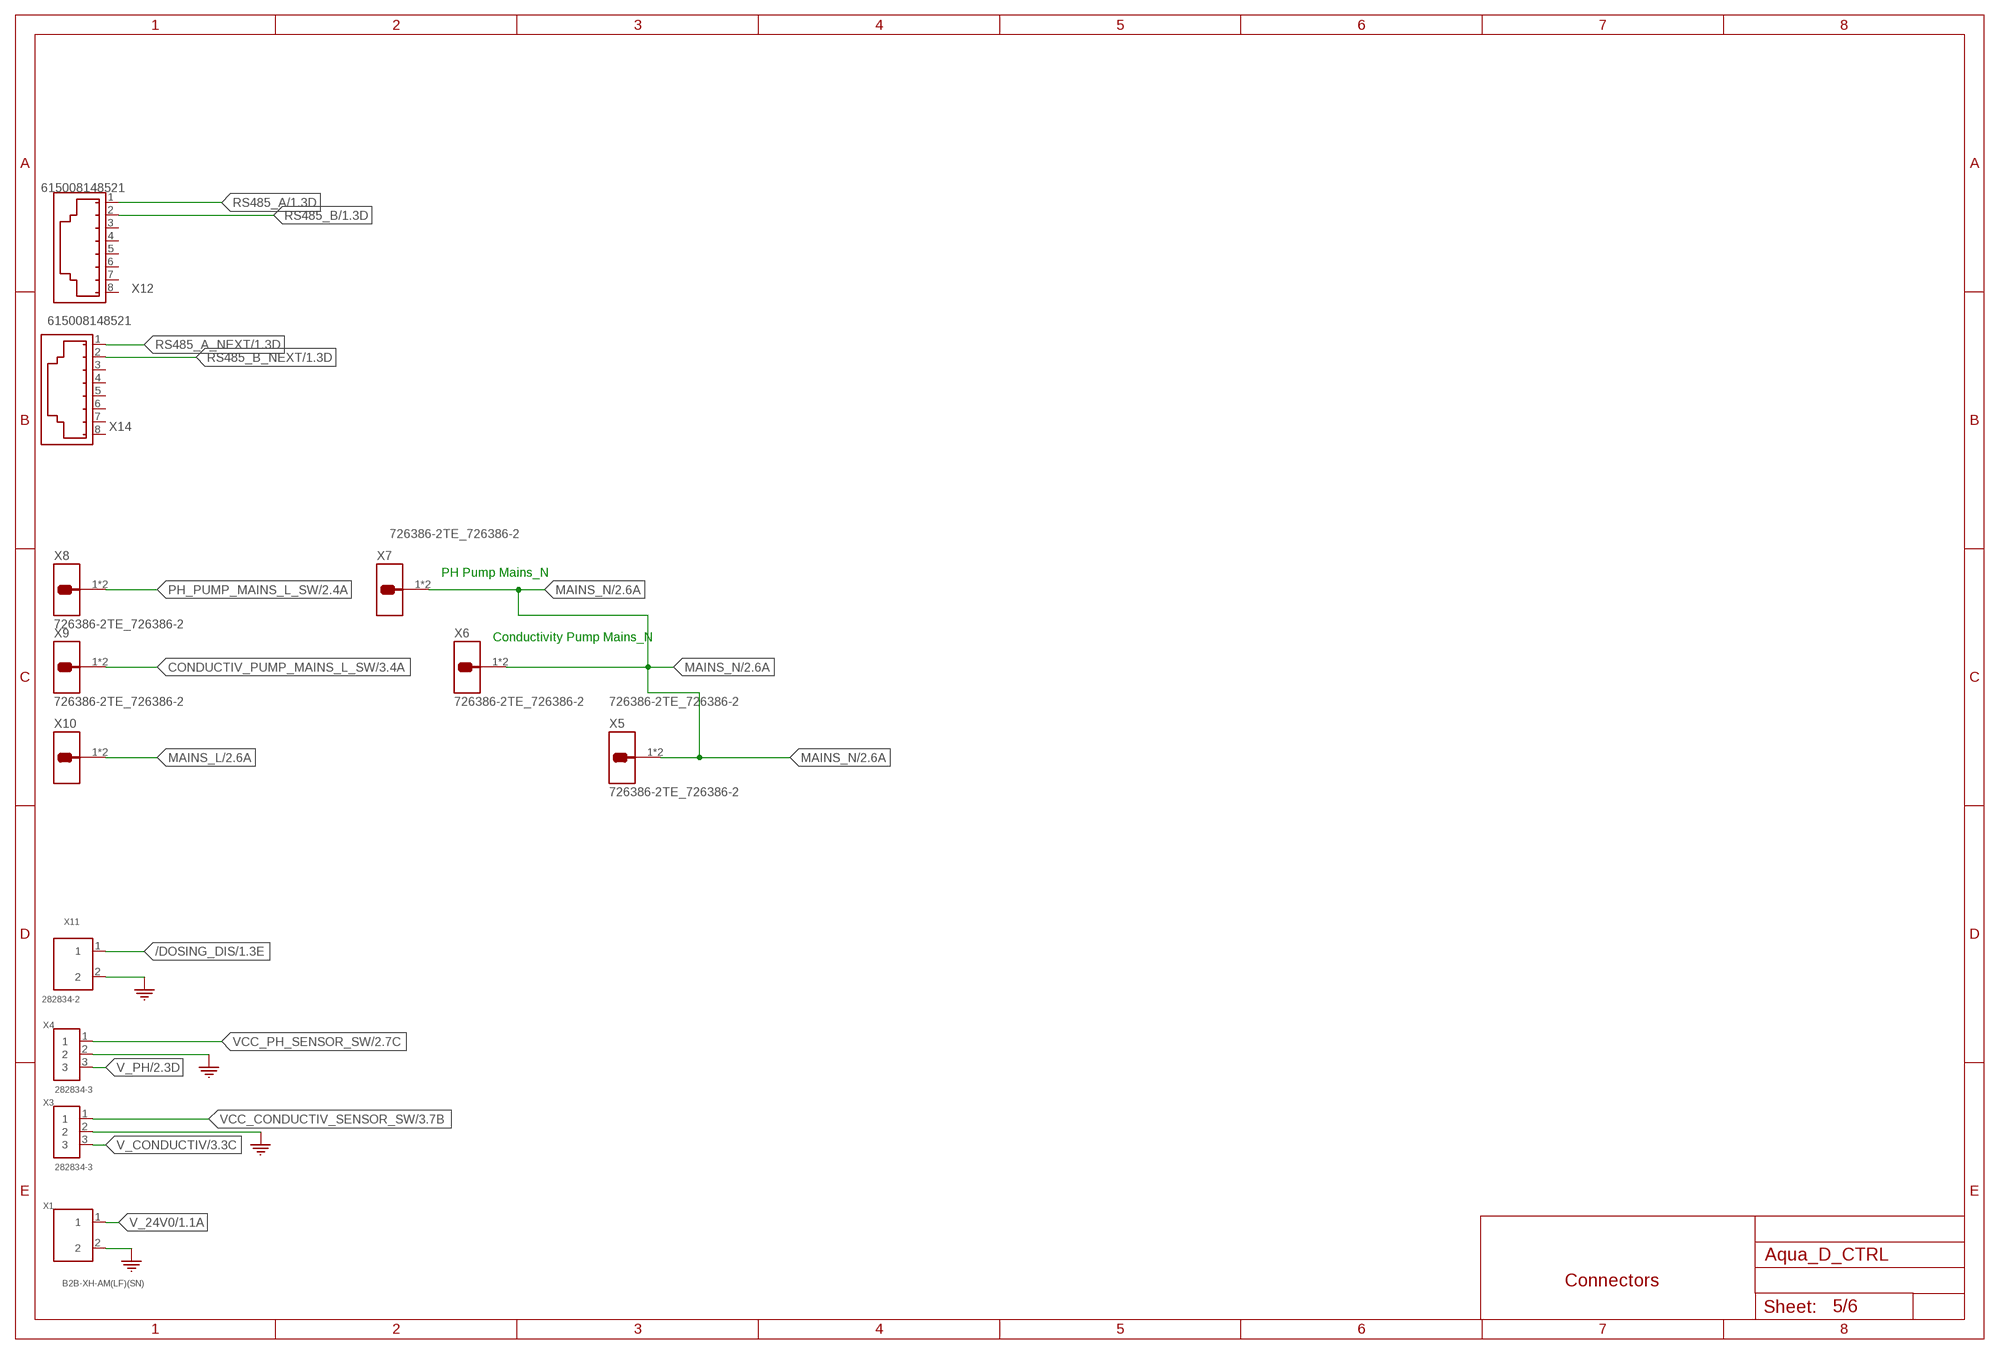
[diagram p8: schematic, sheet 5]

### Parts
X1  B2B-XH-AM(LF)(SN)  [B2B-XH-AM(LF)(SN)]
X3  282834-3  [TE_282834-3_0]
X4  282834-3  [TE_282834-3_0]
X5  726386-2TE_726386-2  [TE_726386-2]
X6  726386-2TE_726386-2  [TE_726386-2]
X7  726386-2TE_726386-2  [TE_726386-2]
X8  726386-2TE_726386-2  [TE_726386-2]
X9  726386-2TE_726386-2  [TE_726386-2]
X10  726386-2TE_726386-2  [TE_726386-2]
X11  282834-2  [TE_282834-2_0]
X12  615008148521  [615008148521]
X14  615008148521  [615008148521]

### Nets
/DOSING_DIS [LV]: X11.1 ; also sheet 1
CONDUCTIV_PUMP_MAINS_L_SW [Mains_L]: X9.1 X9.1-2 ; also sheet 3
GND [LV]: X1.2 X3.2 X4.2 X11.2 ; also sheet 1,2,3,4,6
MAINS_L [Mains_L]: X10.1 X10.1-2 ; also sheet 2
MAINS_N [Mains_N]: X5.1 X5.1-2 X6.1 X6.1-2 X7.1 X7.1-2 ; also sheet 2
PH_PUMP_MAINS_L_SW [Mains_L]: X8.1 X8.1-2 ; also sheet 2
RS485_A [LV]: X12.1 ; also sheet 1
RS485_A_NEXT [LV]: X14.1 ; also sheet 1
RS485_B [LV]: X12.2 ; also sheet 1
RS485_B_NEXT [LV]: X14.2 ; also sheet 1
V_24V0 [LV]: X1.1 ; also sheet 1
V_CONDUCTIV [LV]: X3.3 ; also sheet 3
V_PH [LV]: X4.3 ; also sheet 2
VCC_CONDUCTIV_SENSOR_SW [LV]: X3.1 ; also sheet 3
VCC_PH_SENSOR_SW [LV]: X4.1 ; also sheet 2
Unconnected: X12.3 X12.4 X12.5 X12.6 X12.7 X12.8 X14.3 X14.4 X14.5 X14.6 X14.7 X14.8

### Notes on the sheet
- PH Pump Mains_N
- Conductivity Pump Mains_N
- Connectors

## Sheet 6 of 6
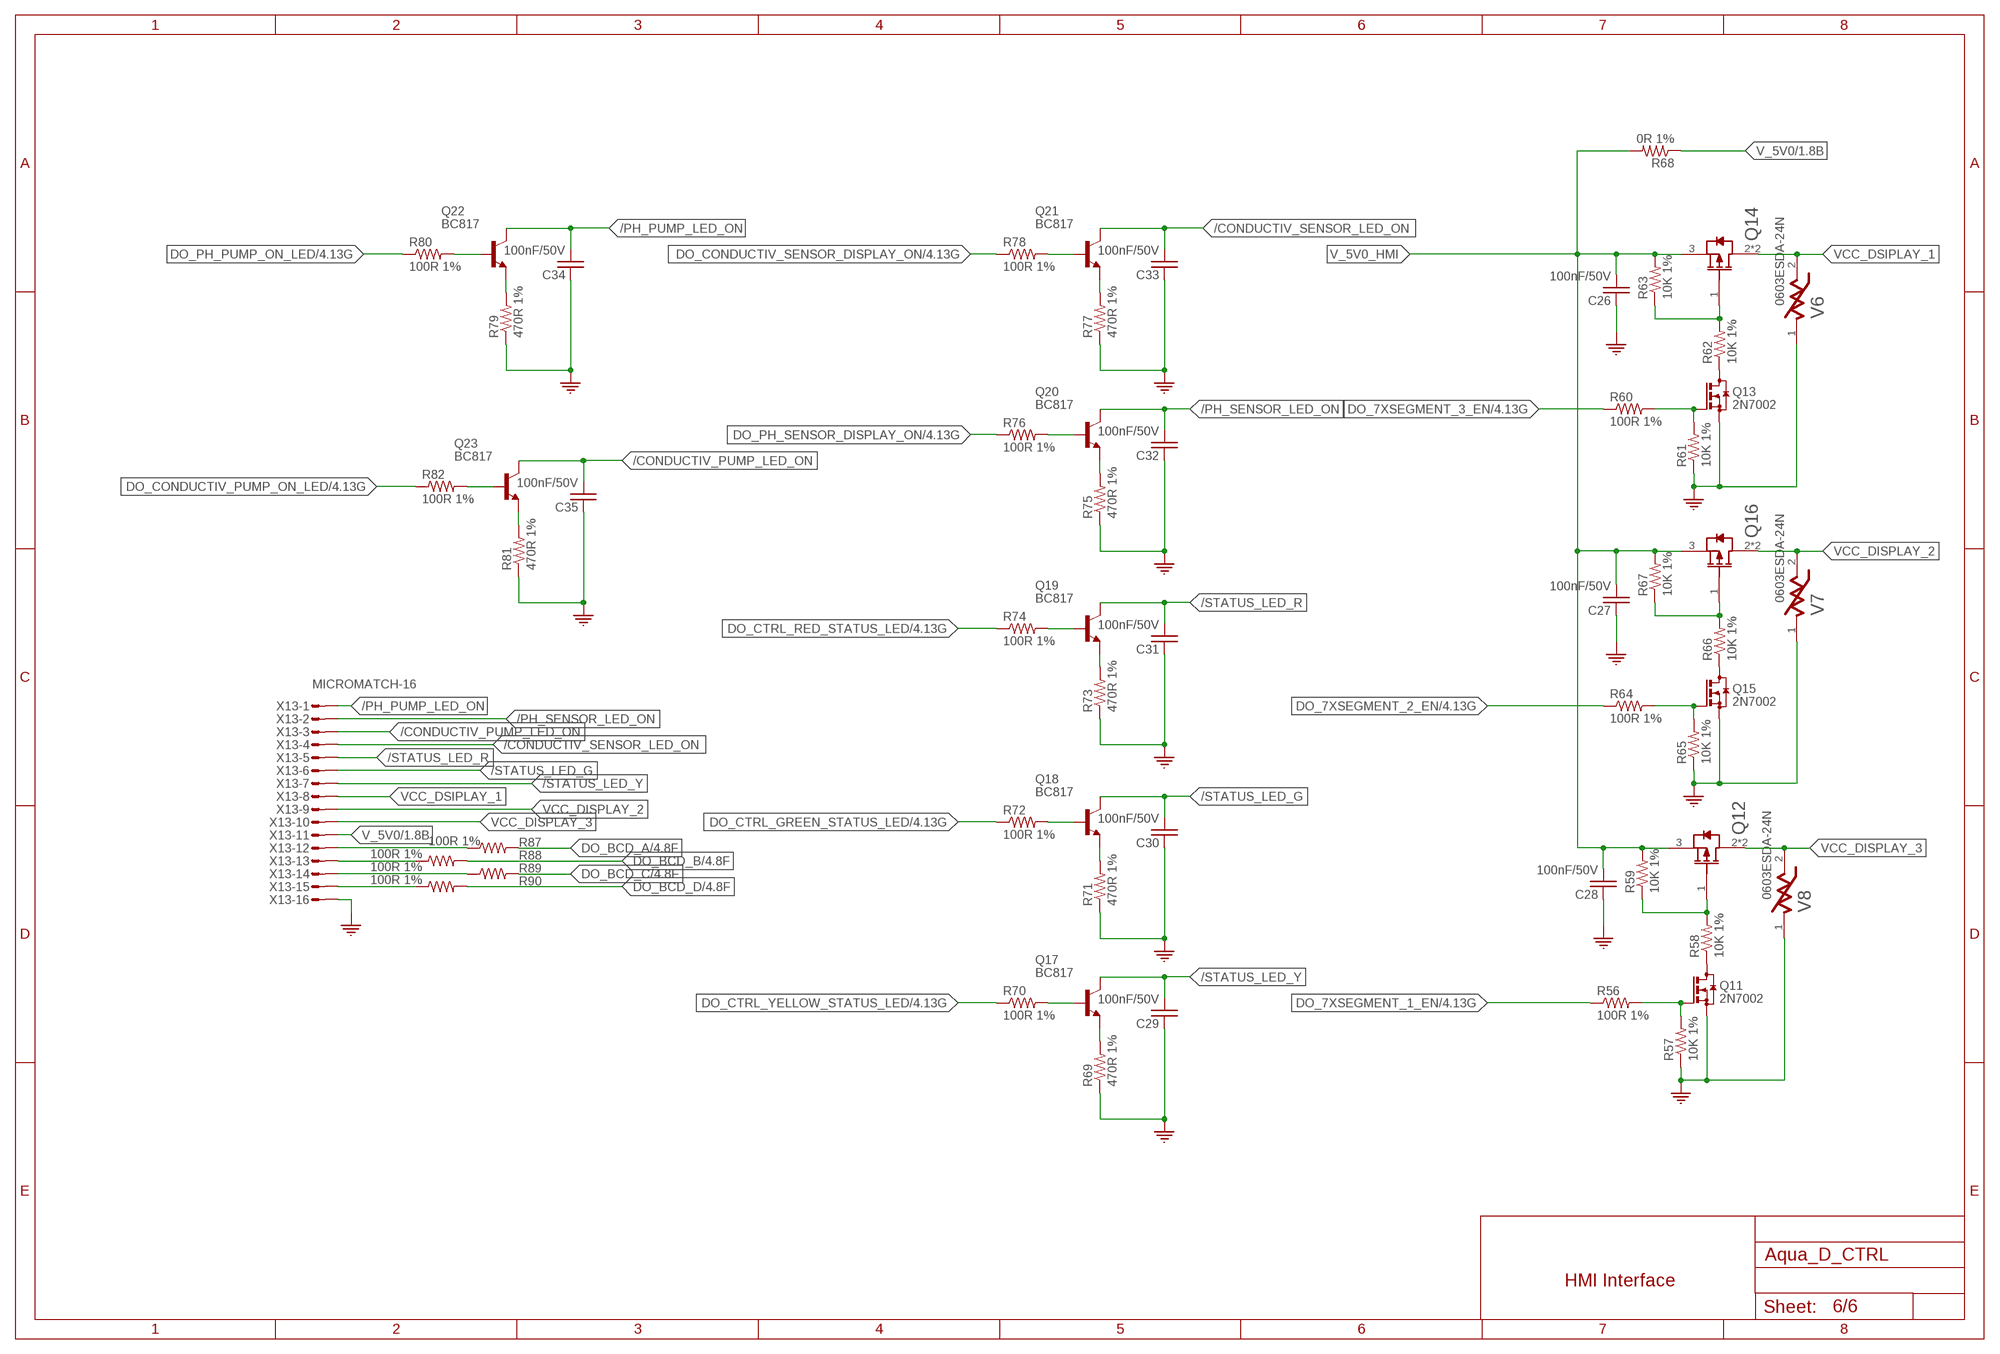
[diagram p9: schematic, sheet 6]

### Parts
C26  100nF/50V  C_0603  [0603]
C27  100nF/50V  C_0603  [0603]
C28  100nF/50V  C_0603  [0603]
C29  100nF/50V  C_0603  [0603]
C30  100nF/50V  C_0603  [0603]
C31  100nF/50V  C_0603  [0603]
C32  100nF/50V  C_0603  [0603]
C33  100nF/50V  C_0603  [0603]
C34  100nF/50V  C_0603  [0603]
C35  100nF/50V  C_0603  [0603]
Q11  2N7002  [SOT23]
Q12  DMP6185SEQ-13  [SOT223]
Q13  2N7002  [SOT23]
Q14  DMP6185SEQ-13  [SOT223]
Q15  2N7002  [SOT23]
Q16  DMP6185SEQ-13  [SOT223]
Q17  BC817  [SOT23]
Q18  BC817  [SOT23]
Q19  BC817  [SOT23]
Q20  BC817  [SOT23]
Q21  BC817  [SOT23]
Q22  BC817  [SOT23]
Q23  BC817  [SOT23]
R56  100R 1%  R_0603  [R0603]
R57  10K 1%  R_0603  [R0603]
R58  10K 1%  R_0603  [R0603]
R59  10K 1%  R_0603  [R0603]
R60  100R 1%  R_0603  [R0603]
R61  10K 1%  R_0603  [R0603]
R62  10K 1%  R_0603  [R0603]
R63  10K 1%  R_0603  [R0603]
R64  100R 1%  R_0603  [R0603]
R65  10K 1%  R_0603  [R0603]
R66  10K 1%  R_0603  [R0603]
R67  10K 1%  R_0603  [R0603]
R68  0R 1%  R_0603  [R0603]
R69  470R 1%  R_0603  [R0603]
R70  100R 1%  R_0603  [R0603]
R71  470R 1%  R_0603  [R0603]
R72  100R 1%  R_0603  [R0603]
R73  470R 1%  R_0603  [R0603]
R74  100R 1%  R_0603  [R0603]
R75  470R 1%  R_0603  [R0603]
R76  100R 1%  R_0603  [R0603]
R77  470R 1%  R_0603  [R0603]
R78  100R 1%  R_0603  [R0603]
R79  470R 1%  R_0603  [R0603]
R80  100R 1%  R_0603  [R0603]
R81  470R 1%  R_0603  [R0603]
R82  100R 1%  R_0603  [R0603]
R87  100R 1%  R_0603  [R0603]
R88  100R 1%  R_0603  [R0603]
R89  100R 1%  R_0603  [R0603]
R90  100R 1%  R_0603  [R0603]
V6  0603ESDA-24N  [0603]
V7  0603ESDA-24N  [0603]
V8  0603ESDA-24N  [0603]
X13  MICROMATCH-16  [MICROMATCH-16]

### Nets
/CONDUCTIV_PUMP_LED_ON [LV]: C35.2 Q23.3(C) X13.3
/CONDUCTIV_SENSOR_LED_ON [LV]: C33.2 Q21.3(C) X13.4
/PH_PUMP_LED_ON [LV]: C34.2 Q22.3(C) X13.1
/PH_SENSOR_LED_ON [LV]: C32.2 Q20.3(C) X13.2
/STATUS_LED_G [LV]: C30.2 Q18.3(C) X13.6
/STATUS_LED_R: C31.2 Q19.3(C) X13.5
/STATUS_LED_Y [LV]: C29.2 Q17.3(C) X13.7
DO_7XSEGMENT_1_EN [LV]: R56.1 ; also sheet 4
DO_7XSEGMENT_2_EN [LV]: R64.1 ; also sheet 4
DO_7XSEGMENT_3_EN [LV]: R60.1 ; also sheet 4
DO_BCD_A [LV]: R87.2 ; also sheet 4
DO_BCD_B [LV]: R88.2 ; also sheet 4
DO_BCD_C [LV]: R89.2 ; also sheet 4
DO_BCD_D [LV]: R90.2 ; also sheet 4
DO_CONDUCTIV_PUMP_ON_LED [LV]: R82.1 ; also sheet 4
DO_CONDUCTIV_SENSOR_DISPLAY_ON [LV]: R78.1 ; also sheet 4
DO_CTRL_GREEN_STATUS_LED [LV]: R72.1 ; also sheet 4
DO_CTRL_RED_STATUS_LED [LV]: R74.1 ; also sheet 4
DO_CTRL_YELLOW_STATUS_LED [LV]: R70.1 ; also sheet 4
DO_PH_PUMP_ON_LED [LV]: R80.1 ; also sheet 4
DO_PH_SENSOR_DISPLAY_ON [LV]: R76.1 ; also sheet 4
GND [LV]: C26.1 C27.1 C28.1 C29.1 C30.1 C31.1 C32.1 C33.1 C34.1 C35.1 Q11.2(S) Q13.2(S) Q15.2(S) R57.1 R61.1 R65.1 R69.1 R71.1 R73.1 R75.1 R77.1 R79.1 R81.1 V6.1 V7.1 V8.1 X13.16 ; also sheet 1,2,3,4,5
N$35 [LV]: R88.1 X13.13
N$36: Q11.1(G) R56.2 R57.2
N$39: Q11.3(D) R58.1
N$40: R87.1 X13.12
N$41: Q12.1(GATE) R58.2 R59.1
N$43 [LV]: R90.1 X13.15
N$44: Q17.2(E) R69.2
N$45: Q17.1(B) R70.2
N$46: Q13.1(G) R60.2 R61.2
N$47: Q13.3(D) R62.1
N$48: Q14.1(GATE) R62.2 R63.1
N$50: Q18.2(E) R71.2
N$51: Q18.1(B) R72.2
N$52: Q15.1(G) R64.2 R65.2
N$53: Q15.3(D) R66.1
N$54: Q16.1(GATE) R66.2 R67.1
N$56: Q19.2(E) R73.2
N$57: Q19.1(B) R74.2
N$58: R89.1 X13.14
N$61: Q20.2(E) R75.2
N$62: Q20.1(B) R76.2
N$64: Q21.2(E) R77.2
N$65: Q21.1(B) R78.2
N$67: Q22.2(E) R79.2
N$68: Q22.1(B) R80.2
N$70: Q23.2(E) R81.2
N$71: Q23.1(B) R82.2
V_5V0 [LV]: R68.1 X13.11 ; also sheet 1
V_5V0_HMI [LV]: C26.2 C27.2 C28.2 Q12.3(SOURCE) Q14.3(SOURCE) Q16.3(SOURCE) R59.2 R63.2 R67.2 R68.2
VCC_DISPLAY_2 [LV]: Q16.2(DRAIN) Q16.4(DRAIN) V7.2 X13.9
VCC_DISPLAY_3 [LV]: Q12.2(DRAIN) Q12.4(DRAIN) V8.2 X13.10
VCC_DSIPLAY_1 [LV]: Q14.2(DRAIN) Q14.4(DRAIN) V6.2 X13.8

### Notes on the sheet
- HMI Interface

## Power pins joined to a net without a drawn wire
VBATT: U2.14(A:VBATT)
VCC_USBHS: U2.40(A:VCC_USBHS)
VREFH0: U2.130(B:VREFH0)
VREFL0: U2.129(B:VREFL0)
VSS_USB: U2.37(A:VSS_USB)

## Library data of the parts
C1 = Labops_Lib_AH:R49AN347050B1M: 0.47µF X Cap 330V 800V Polypropylene (PP), Metallized Radial; DESCRIPTION: Film,X1,470nF/330Vac,THT; LIB_STATUS: Verified; MFN: R49AN347050B1M; MFR: Kemet; OUR_STOCK: 8; PART_VALUE: 470nF/330VAC; PRICE-1: 1.51; SUPPLIER-1: Digikey
C2 = Labops_Lib_AH:ERP610W471MEF0; DESCRIPTION: 470 pF ±20% 760VAC Ceramic Capacitor Y5U (E) Radial X1,Y1; LIB_STATUS: Prototype; MFN: ERP610W471MEF0; MFR: Kemet; OUR_STOCK: 150; PART_VALUE: 470pF/760VAC; PRICE-1: 0.42; SUPPLIER-1: Digikey
C3-C7 C12-C17 C19-C41 C44 C49-C51 C53 C55-C68 = Labops_Lib_AH:C_0603; MFN: Open Source
C8-C11 = Labops_Lib_AH:C_0603; MFN: Open Source; PART_VALUE: 100nF/100V
C18 = Labops_Lib_AH:50PX470MEFC10X20: Electrolytic Cap, 470µF, 25V, Low ESR, Kemet, Pitch=5mm, Dia=10mm, L=12,5mm; DESCRIPTION: 470uF ±20% 50V 10mm 20mm 5mm 2000Hrs @ 105℃ -55℃ ~ +105℃; LIB_STATUS: Prototype; MFN: 50PX470MEFC10X20; MFR: Rubicon; OUR_STOCK: 20; PART_VALUE: 470uF/50V; PRICE-1: 0.14; SUPPLIER-1: LCSC; TECHNOLOGY: THT
D1 D2 D11 = Labops_Lib_AH:SS14; DESCRIPTION: Diode Schottky 1A/40V (SMA); LIB_STATUS: Prototype; MFN: SS14-LTP; MFR: MCC; OUR_STOCK: 10; PART_VALUE: Schottky 1A/40V; PRICE-1: 0.05; SUPPLIER-1: LCSC
D3 = Labops_Lib_AH:MMBZ4696-HE3-18: Zener 9.1 Volt 0.225W 5%; DESCRIPTION: Zener Diodes 9.1 Volt 0.225W 5% AUTO; MFN: MMBZ4696-HE3-18; MFR: Vishay; OUR_STOCK: 500; PART_VALUE: 9V 5%; PRICE-1: 0.06; SUPPLIER-1: Mouser
D4 D6 = Labops_Lib_AH:PESD36VS2UT; DESCRIPTION: ESD Diode Voff=36V, Vclamp=60V, SOT23; MFN: PESD36VS2UT; MFR: NXP; OUR_STOCK: 150; PRICE-1: 0.15; SUPPLIER-1: Mouser
D5 D7-D10 D13 = Labops_Lib_AH:BAS40-04,215: Schottky dual series, SOT23, 40V, 120mA; DESCRIPTION: Schottky dual series, SOT23, 40V, 120mA; MFN: BAS40-04,215; MFR: NXP; PART_VALUE: BAS40-04; PRICE-1: 0.19; SUPPLIER-1: Mouser
D12 = Labops_Lib_AH:26-21/GPC-F3138B/CA; DESCRIPTION: Green SMD LED 1206, 160mcd; LIB_STATUS: Prototype; MFN: 26-21/GPC-F3138B/CA; MFR: Everlight; OUR_STOCK: 50; PART_VALUE: Green LED; PRICE-1: 0.06; SUPPLIER-1: LCSC
F1 = Labops_Lib_AH:696101000002; DESCRIPTION: Fuse Block 10 A 250V 1 Circuit Cartridge Through Hole; LIB_STATUS: Prototype; MFN: 696101000002; MFR: Wurth Elektronik; OUR_STOCK: 10; PART_VALUE: 10A 5mmx20mm; PRICE-1: 0.64; SUPPLIER-1: Digikey
FID1 FID2 = Labops_Lib_AH:FIDUCIAL
H1-H4 = holes:MOUNT-PAD-ROUND: MOUNTING PAD, round
IC1 = Labops_Lib_AH:SN65HVD3082EDR; DESCRIPTION: RS485 Transciever, 200Kbps, SOIC-8 , ALT: TP8485E-SR (3Peak); LIB_STATUS: Prototype; MFN: SN65HVD3082EDR; MFR: TI,3Peak; OUR_STOCK: 10; PART_VALUE: RS485 Driver; PRICE-1: 0.30; SUPPLIER-1: LCSC
IC2 = Labops_Lib_AH:CSTNE8M00G520000R0: 8.000MHz ±0.50% Ceramic Resonator with Built in Capacitor 10pF 40Ω Stability ±0.20% 3-SMD; DESCRIPTION: 8MHz ±0.5% 10pF 40Ω SMD3213-3P Ceramic Resonators; LIB_STATUS: Prototype; MFN: CSTNE8M00G520000R0; MFR: Murata; PART_VALUE: 8MHz, 0.5%; PRICE-1: 0.12; SUPPLIER-1: LCSC
IC3 IC4 = Labops_Lib_AH:LT6106CS5#TRPBF; DESCRIPTION: Current Sense Amplfier 36V, SOT23-5; MFN: LT6106CS5#TRPBF; MFR: Analog Devices; PART_VALUE: LT6106CS5; PRICE-1: 1.5; SUPPLIER-1: Mouser
IC5 = Labops_Lib_AH:TPS54202DDCR; DESCRIPTION: 2A 28V SOT-23-6 Sync Buck; LIB_STATUS: Prototype; MFN: TPS54202DDCR; MFR: Texas Instruments; OUR_STOCK: 40; PART_VALUE: TPS54202; PRICE-1: 1.8; SUPPLIER-1: LCSC
IC6 = Labops_Lib_AH:LD1117S33TR: IC REG LINEAR 3.3V 800mA SOT223; DESCRIPTION: LDO,Fixed 15V 3.3V 1.3V @ 800mA SOT-223; LIB_STATUS: Verified; MFN: LD1117S33TR; MFR: STmicro, Diodes, TI,; OUR_STOCK: 10; PART_VALUE: xx1117x33xx; PRICE-1: 0.07; SUPPLIER-1: LCSC
IC8 = Labops_Lib_AH:LM317AEMP: Linear Voltage Regulator IC Positive Adjustable Output 1.5A SOT-223-4
J1 = Labops_Lib_AH:ESP32-PICO-KIT; AVAILABILITY: In Stock; DESCRIPTION: ESP32-PICO-D4 series Transceiver; 802.11 b/g/n (Wi-Fi, WiFi, WLAN), Bluetooth® Smart Ready 4.x Dual Mode Evaluation Board; MFR: Espressif Systems; MPN: ESP32-PICO-KIT; PACKAGE: None; PRICE: None
K1 K2 = Labops_Lib_AH:KB20C06A; DESCRIPTION: Solid State Relay, Out AC 280VAC, In DC 32V; MFN: KB20C06A; MFR: Kyotto
L1 = Labops_Lib_AH:SRN8040TA-220M: FIXED IND 22UH 2.9A SMD, 73m-Ohm, Bourns; DESCRIPTION: FIXED IND 22UH 2.9A SMD, 73m-Ohm, Bourns; LIB_STATUS: Verified; MFN: SRN8040TA-220M; MFR: Bourns; OUR_STOCK: 10; PART_VALUE: 22uH/2.9A; SUPPLIER-1: Digikey; TECHNOLOGY: SMD
Q1 Q3 Q5 Q6 Q8 Q12 Q14 Q16 = Labops_Lib_AH:DMP6185SEQ-13: PMOSFET, SOT-223, 60V, 3A; DESRIPTION: PMOSFET 60V, 3A, SOT223; MFN: DMP6185SEQ-13; MFR: Diodes; OUR_STOCK: 100; PART_VALUE: DMP6185SEQ-13; PRICE-1: 0.18; SUPPLIER-1: LCSC
Q2 Q4 Q7 Q9 Q11 Q13 Q15 = Labops_Lib_AH:2N7002; DESCRIPTION: NMOSFET, 500mA, 60V, Vth 2.5V; LIB_STATUS: Prototype; MFN: 2N7002; MFR: Diodes, Guangdong Hotetech,NXP; OUR_STOCK: 100; PART_VALUE: NMOSFET; PRICE-1: 0.02; SUPPLIER-1: LCSC
Q10 Q17-Q23 = Labops_Lib_AH:BC817; DESCRIPTION: Transistor BJT NPN SOT23 45V 0.5A; MFN: BC817; MFR: NXP; PRICE-1: 0.03; SUPPLIER-1: Mouser
R1-R5 R9-R13 R24-R27 R29-R35 R37-R39 = 3D_MIG_Controller:R_0603
R6 R7 = Labops_Lib_AH:R_2010; PRICE-1: 0.11; SUPPLIER-1: Digikey
R8 R46 = Labops_Lib_AH:RNF12FTD10M0; DESCRIPTION: 10 MOhms ±1% 0.5W, 1/2W Through Hole Resistor Axial Flame Retardant Coating, Safety Metal Film; LIB_STATUS: Prototype; MFN: RNF12FTD10M0; MFR: Stackpole Electronics Inc; OUR-STOCK: 20; PART_VALUE: 10Meg 5%; PRICE-1: 0.29; SUPPLIER-1: Digikey
R14-R17 R19 R20 R22 R23 R40-R45 R47-R50 R52 R53 R55-R84 R87-R94 R96 R97 = Labops_Lib_AH:R_0603; MFN: Open Source
R18 R21 R51 R54 R85 R86 = Labops_Lib_AH:R_1206; LIB_STATUS: Verified; MFN: R_Open_1206
R28 R36 = Labops_Lib_AH:R_2010; MFN: RL73K2HR68JTE; PART_VALUE: 680mR; PRICE-1: 0.11; SUPPLIER-1: Digikey
SW1 = Labops_Lib_AH:L101011MS02Q; DESCRIPTION: Slide Switch, SPST, 4A, 28VDC; LIB_STATUS: Prototype; MFN: L101011MS02Q; MFR: C&K; PART_VALUE: SW 4A/28V; PRICE-1: 1.66; SUPPLIER-1: Mouser
U2 = Labops_Lib_AH:R7FA6M5BG3CFB; MFN: R7FA6M5BG3CFB#AA0; MFR: Renesas
V1 V4 = Labops_Lib_AH:B72205S0271K101: VARISTOR 205V 800A DISC 5MM; LIB_STATUS: Verified; MFN: B72205S0271K1011; MFR: EPCOS; OUR_STOCK: 10; PART_VALUE: 430V, 400A; PRICE-1: 0.31; SUPPLIER-1: Digikey
V2 V3 V6-V8 = Labops_Lib_AH:0603ESDA-24N; DESCRIPTION: Varistor 0603 SMD Bidirectional 50V 24V; MFN: 0603ESDA-24N; MFR: BORN; PRICE-1: 0.01; SUPPLIER-1: LCSC
V5 = Labops_Lib_AH:B72205S0271K101: VARISTOR 205V 800A DISC 5MM
X1 = Labops_Lib_AH:B2B-XH-AM(LF)(SN); DESCRIPTION: Connector, 2 pins, Header THT , Pitch 2.5mm, JST, Vertical; MFN: B2B-XH-AM(LF)(SN); MFR: JST; PRICE-1: 0.03; SUPPLIER-1: LCSC; TECHNOLOGY: THT
X2 = Labops_Lib_AH:WF2549-2WS05S0B01; DESCRIPTION: X10, 10 Pins, Header, Pitch 2.54 wire to board 2xrows, THT; MFN: WF2549-2WS05S0B01; MFR: WCON; PRICE-1: 0.25; SUPPLIER-1: LCSC
X3 X4 = Labops_Lib_AH:282834-3; DESCRIPTION: Connector 3 Position THT 1 Row 2.54mm pitch side entry wire to board; MFN: 282834-3; MFR: TE; PRICE-1: 1.7; SUPPLIER-1: Digikey
X5-X10 = Labops_Lib_AH:726386-2: Terminals, Faston, GDS-Flachstecker 6.3x0.8mm, TE; CENTROID_NOT_SPECIFIED: No; CONN_GENDER: Male; CONN_ORIENTATION: Straight; CONTACT_MATERIAL: Tin; DATASHEET: http://www.te.com/commerce/DocumentDelivery/DDEController?Action=showdoc&DocId=Customer+Drawing%7F726386%7FG%7Fpdf%7FEnglish%7FENG_CD_726386_G.pdf%7F726386-2; DEVICE_CLASS_L1: Connectors; DEVICE_CLASS_L2: Terminal Blocks | Terminals; DEVICE_CLASS_L3: unset; DIGIKEY_DESCRIPTION: CONN QC TAB 0.250 SOLDER; DIGIKEY_PART_NUMBER: A114371-ND; HEIGHT: 10mm; LEAD_FREE: yes; MF: TE; MFG_PACKAGE_IDENT: 726386-2; MFG_PACKAGE_IDENT_DATE: 0; MFG_PACKAGE_IDENT_REV: 0; MOUSER_DESCRIPTION: Terminals GDS-FLACHSTECK 6.3; MOUSER_PART_NUMBER: 571-726386-2; MPN: 726386-2; PACKAGE: PTH_TERMINAL_8MM0_0MM8; PREFIX: J; ROHS: yes; TEMPERATURE_RANGE_HIGH: +110°C; TEMPERATURE_RANGE_LOW: -30°C; VERIFICATION_VERSION: 0.0.0.1
X11 = Labops_Lib_AH:282834-2; DESCRIPTION: Connector Header Terminal Block 2 Positions, 1 Row, 2.54mm, THT; MFN: 282834-2; MFR: TE; PRICE-1: 0.8; SUPPLIER-1: Digikey
X12 X14 = Labops_Lib_AH:615008148521: WR-MJ Modular Jack Horizontal Plastic 8P8C Tab Up KIND PROPERTIES Quality Class:500 Mating cycles General Information Operating Temperature:-40 up to +85 °C Compliance: RoHS Electrical Properties IR 1:1.5A Working Voltage:120V (AC) Withstanding Voltage:1000V (AC) Contact Resistance:20mΩ RISO:500 MΩ Material Properties Insulator MateriaL:PBT Insulator Flammability Rating:UL94 V-0 Color:Black Contact Material Copper Alloy Contact Plating:Gold Contact Type:Stamped Packaging Properties Packaging:Tray <https://www.we-online.com/catalog/media/o76656v209%20Family_WR-MJ_Plastic_Horizontal_Tab-UP_615008148521.jpg> Details see: https://www.we-online.com/catalog/en/MJ_HORIZONTAL_PLASTIC_8P8C_TAB_UP/ Updated by Yingchun,Shan 2020-01-06 2020 (C) Würth Elektronik; DESCRIPTION: RJ45 unshielded 8P8C; MFN: 615008148521; MFR: Wurth Elektronik; PART_VALUE: 615008148521; TYPE: Horizontal
X13 = con-amp-micromatch:MICROMATCH-16: MicroMaTch 16 8-215464-6 / 1-215464-6 Drawing Number C-215464 DDEController.pdf; MF: FARNELL; MPN: 8-215464-6; OC_FARNELL: 3784680; OC_NEWARK: 26H3309

## Net classes
1 Mains_N: clearance 3.2 mm to class 0, clearance 0.2 mm
3 LV: clearance 8 mm to class 1
4 Mains_L: clearance 8 mm to class 0, clearance 3.2 mm to class 1, clearance 8 mm to class 3